# EAGLE design LARIX_V2 (EAGLE 6.5.0)
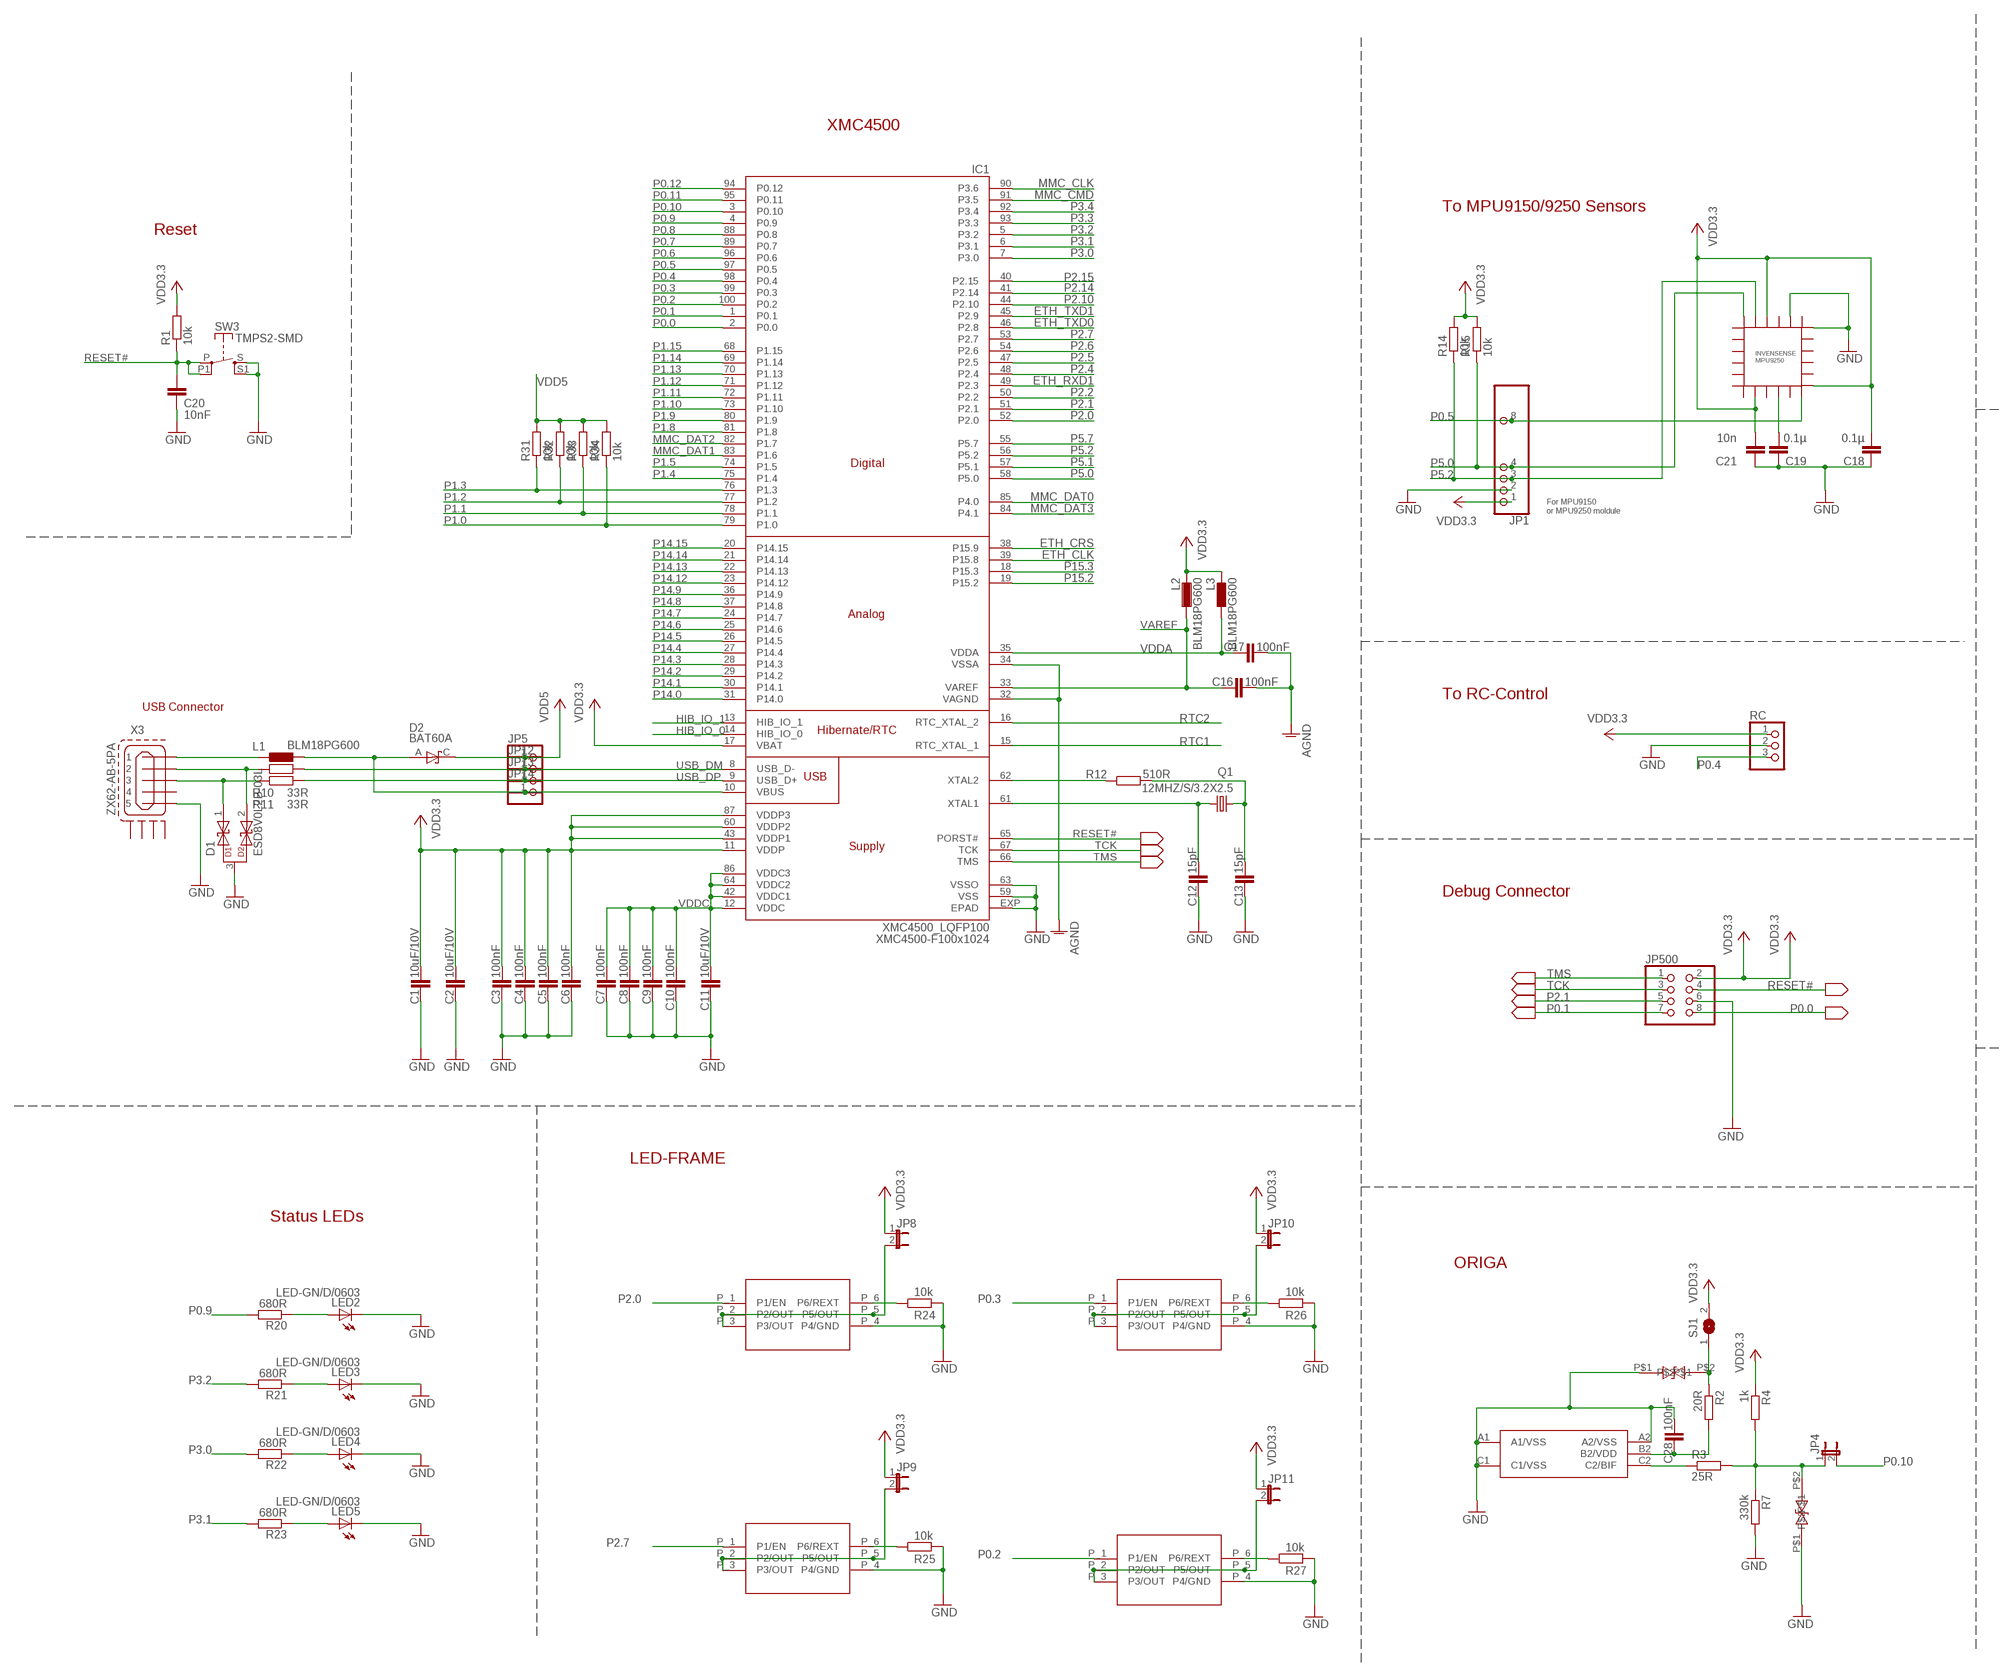
[diagram p0: schematic, sheet 1, part 1 of 2]
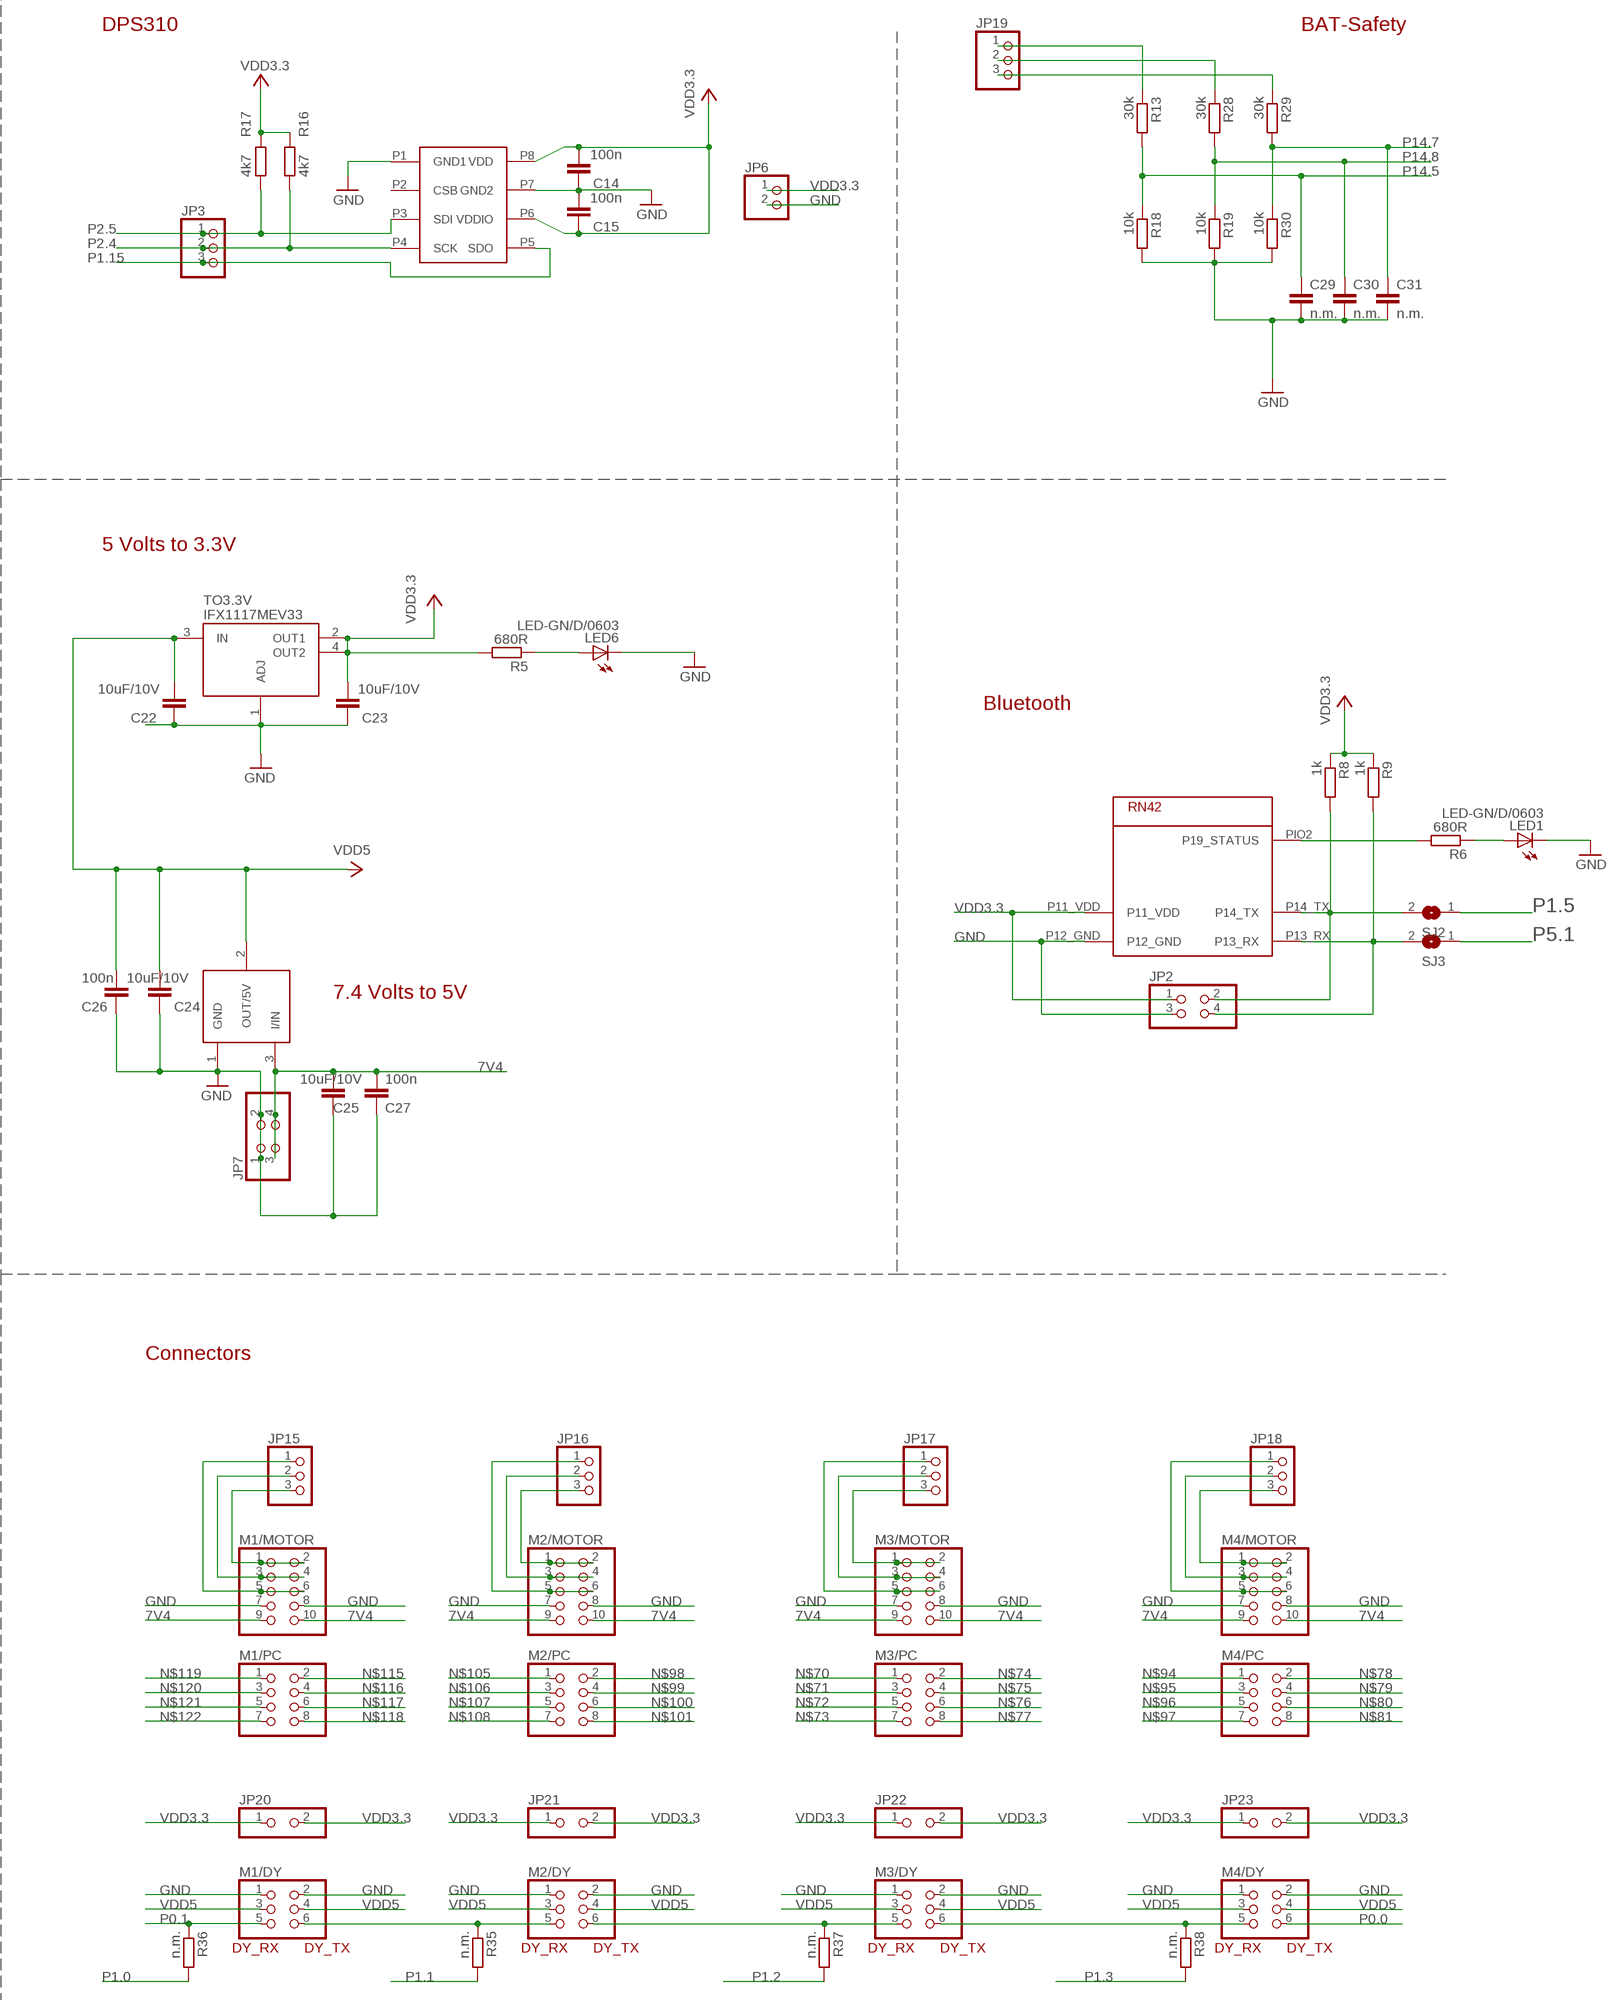
[diagram p1: schematic, sheet 1, part 2 of 2]

## Parts
C1  10uF/10V  C-EUC0805K  [C0805K]
C2  10uF/10V  C-EUC0805K  [C0805K]
C3  100nF  C-EUC0603  [C0603]
C4  100nF  C-EUC0603  [C0603]
C5  100nF  C-EUC0603  [C0603]
C6  100nF  C-EUC0603  [C0603]
C7  100nF  C-EUC0603  [C0603]
C8  100nF  C-EUC0603  [C0603]
C9  100nF  C-EUC0603  [C0603]
C10  100nF  C-EUC0603  [C0603]
C11  10uF/10V  C-EUC0805K  [C0805K]
C12  15pF  C-EUC0603  [C0603]
C13  15pF  C-EUC0603  [C0603]
C14  100n  C-EUC0603  [C0603]
C15  100n  C-EUC0603  [C0603]
C16  100nF  C-EUC0603  [C0603]
C17  100nF  C-EUC0603  [C0603]
C18  0.1µ  C-EUC0603  [C0603]
C19  0.1µ  C-EUC0603  [C0603]
C20  10nF  C-EUC0603  [C0603]
C21  10n  C-EUC0603  [C0603]
C22  10uF/10V  C-EUC0805K  [C0805K]
C23  10uF/10V  C-EUC0805K  [C0805K]
C24  10uF/10V  C-EUC0805K  [C0805K]
C25  10uF/10V  C-EUC0805K  [C0805K]
C26  100n  C-EUC0603  [C0603]
C27  100n  C-EUC0603  [C0603]
C28  100nF  C-EUC0603  [C0603]
C29  n.m.  C-EUC0603  [C0603]
C30  n.m.  C-EUC0603  [C0603]
C31  n.m.  C-EUC0603  [C0603]
D1  ESD8V0L2B-03L  [TSLP-3-1]
D2  BAT60A  BAT60  [SOD323-R]
IC1  XMC4500_LQFP100  XMC4400_LQFP100  [P/PG-LQFP-100-11]
IC2  INVENSENSE9250EHERBY  [QFN3X3-24+]
JP1  PINHD-1X10  [1X10]
JP2  PINHD-2X2  [2X02]
JP3  PINHD-1X3  [1X03]
JP4  JP1E  [JP1]
JP5  PINHD-1X1  [1X01]
JP6  PINHD-1X2  [1X02]
JP7  PINHD-2X2  [2X02]
JP8  JP1E  [JP1]
JP9  JP1E  [JP1]
JP10  JP1E  [JP1]
JP11  JP1E  [JP1]
JP12  PINHD-1X1  [1X01]
JP13  PINHD-1X1  [1X01]
JP14  PINHD-1X1  [1X01]
JP15  PINHD-1X3  [1X03]
JP16  PINHD-1X3  [1X03]
JP17  PINHD-1X3  [1X03]
JP18  PINHD-1X3  [1X03]
JP19  PINHD-1X3  [1X03]
JP20  PINHD-2X3  [2X03]
JP21  PINHD-2X3  [2X03]
JP22  PINHD-2X3  [2X03]
JP23  PINHD-2X3  [2X03]
JP500  PINHD-2X4  [2X04]
L1  BLM18PG600  L_EU_L0603  [L1608]
L2  BLM18PG600  L_EU_L0603  [L1608]
L3  BLM18PG600  L_EU_L0603  [L1608]
LED1  LED-GN/D/0603  LEDCHIPLED_0603  [CHIPLED_0603]
LED2  LED-GN/D/0603  LEDCHIPLED_0603  [CHIPLED_0603]
LED3  LED-GN/D/0603  LEDCHIPLED_0603  [CHIPLED_0603]
LED4  LED-GN/D/0603  LEDCHIPLED_0603  [CHIPLED_0603]
LED5  LED-GN/D/0603  LEDCHIPLED_0603  [CHIPLED_0603]
LED6  LED-GN/D/0603  LEDCHIPLED_0603  [CHIPLED_0603]
M1/DY  PINHD-2X3  [2X03]
M1/MOTOR  PINHD-2X5  [2X05]
M1/PC  PINHD-2X4  [2X04]
M2/DY  PINHD-2X3  [2X03]
M2/MOTOR  PINHD-2X5  [2X05]
M2/PC  PINHD-2X4  [2X04]
M3/DY  PINHD-2X3  [2X03]
M3/MOTOR  PINHD-2X5  [2X05]
M3/PC  PINHD-2X4  [2X04]
M4/DY  PINHD-2X3  [2X03]
M4/MOTOR  PINHD-2X5  [2X05]
M4/PC  PINHD-2X4  [2X04]
Q1  12MHZ/S/3.2X2.5  NX3225_2  [32X25_4PAD]
R1  10k  R-EU_R0603  [R0603]
R2  20R  R-EU_R0603  [R0603]
R3  25R  R-EU_R0603  [R0603]
R4  1k  R-EU_R0603  [R0603]
R5  680R  R-EU_R0603  [R0603]
R6  680R  R-EU_R0603  [R0603]
R7  330k  R-EU_R0603  [R0603]
R8  1k  R-EU_R0603  [R0603]
R9  1k  R-EU_R0603  [R0603]
R10  33R  R-EU_R0603  [R0603]
R11  33R  R-EU_R0603  [R0603]
R12  510R  R-EU_R0603  [R0603]
R13  30k  R-EU_R0603  [R0603]
R14  10k  R-EU_R0603  [R0603]
R15  10k  R-EU_R0603  [R0603]
R16  4k7  R-EU_R0603  [R0603]
R17  4k7  R-EU_R0603  [R0603]
R18  10k  R-EU_R0603  [R0603]
R19  10k  R-EU_R0603  [R0603]
R20  680R  R-EU_R0603  [R0603]
R21  680R  R-EU_R0603  [R0603]
R22  680R  R-EU_R0603  [R0603]
R23  680R  R-EU_R0603  [R0603]
R24  10k  R-EU_R0603  [R0603]
R25  10k  R-EU_R0603  [R0603]
R26  10k  R-EU_R0603  [R0603]
R27  10k  R-EU_R0603  [R0603]
R28  30k  R-EU_R0603  [R0603]
R29  30k  R-EU_R0603  [R0603]
R30  10k  R-EU_R0603  [R0603]
R31  10k  R-EU_R0603  [R0603]
R32  10k  R-EU_R0603  [R0603]
R33  10k  R-EU_R0603  [R0603]
R34  10k  R-EU_R0603  [R0603]
R35  n.m.  R-EU_R0603  [R0603]
R36  n.m.  R-EU_R0603  [R0603]
R37  n.m.  R-EU_R0603  [R0603]
R38  n.m.  R-EU_R0603  [R0603]
RC  PINHD-1X3  [1X03]
SJ1  SJ  [SJ]
SJ2  SJ  [SJ]
SJ3  SJ  [SJ]
SW3  TMPS2-SMD  FSM2JSMA  [FSM2JSMA]
TO3.3V  IFX1117MEV33  IFX1117  [SOT223]
U$7  TLE4284V50  [INF-PG-TO252-3-1_L_1PRIMARY]
U$8  DPS310DRUCKSENSOR  [LGA8R125P0X4_500X300X120]
U$9  ESD218-B1-02EL  [TSLP-2-20]
U$11  ORIGA2L  [WLB-5]
U$13  BCU320  [SC74]
U$15  BCU320  [SC74]
U$16  BLUETOOTHRN42  [ROVING-SHORT]
U$18  BCU320  [SC74]
U$20  BCU320  [SC74]
U$22  ESD218-B1-02EL  [TSLP-2-20]
X3  ZX62-AB-5PA  ZX62-AB-5PA_MICRO-USB  [ZX62-AB-5PA_MICRO-USB]

## Nets
7V4: C25.1 C27.1 JP7.3 JP7.4 M1/MOTOR.9 M1/MOTOR.10 M2/MOTOR.9 M2/MOTOR.10 M3/MOTOR.9 M3/MOTOR.10 M4/MOTOR.9 M4/MOTOR.10 U$7.3(I/IN)
AGND: C16.2 C17.2 IC1.32(VAGND) IC1.34(VSSA)
BLUETOOTHLED: R6.2 U$16.PIO2(P19_STATUS)
ETH_CLK: IC1.39(P15.8)
ETH_CRS: IC1.38(P15.9)
ETH_RXD1: IC1.49(P2.3)
ETH_TXD0: IC1.46(P2.8)
ETH_TXD1: IC1.45(P2.9)
GND: C1.2 C2.2 C3.2 C4.2 C5.2 C6.2 C7.2 C8.2 C9.2 C10.2 C11.2 C12.2 C13.2 C14.2 C15.1 C18.1 C19.1 C20.2 C21.1 C22.2 C23.2 C24.2 C25.2 C26.2 C27.2 C28.1 C29.2 C30.2 C31.2 D1.3 IC1.59(VSS) IC1.63(VSSO) IC1.EXP(EPAD) IC2.18 IC2.20 JP1.2 JP2.3 JP6.2 JP7.1 JP7.2 JP500.6 LED1.C LED2.C LED3.C LED4.C LED5.C LED6.C M1/DY.1 M1/DY.2 M1/MOTOR.7 M1/MOTOR.8 M2/DY.1 M2/DY.2 M2/MOTOR.7 M2/MOTOR.8 M3/DY.1 M3/DY.2 M3/MOTOR.7 M3/MOTOR.8 M4/DY.1 M4/DY.2 M4/MOTOR.7 M4/MOTOR.8 R7.2 R18.2 R19.2 R24.2 R25.2 R26.2 R27.2 R30.2 RC.2 SW3.S SW3.S1(S) TO3.3V.1(ADJ) U$7.1(GND) U$8.P1(GND1) U$8.P7(GND2) U$9.P$1 U$11.A1(A1/VSS) U$11.A2(A2/VSS) U$11.C1(C1/VSS) U$13.P_4(P4/GND) U$15.P_4(P4/GND) U$16.P12_GND U$18.P_4(P4/GND) U$20.P_4(P4/GND) U$22.P$1 X3.5
HIB_IO_0: IC1.14(HIB_IO_0)
HIB_IO_1: IC1.13(HIB_IO_1)
MMC_CLK: IC1.90(P3.6)
MMC_CMD: IC1.91(P3.5)
MMC_DAT0: IC1.85(P4.0)
MMC_DAT1: IC1.83(P1.6)
MMC_DAT2: IC1.82(P1.7)
MMC_DAT3: IC1.84(P4.1)
N$1: LED2.A R20.1
N$2: C28.2 R2.2 U$11.B2(B2/VDD)
N$3: LED3.A R21.1
N$6: IC1.62(XTAL2) R12.1
N$7: C13.1 Q1.3 R12.2
N$8: C12.1 IC1.61(XTAL1) Q1.1
N$9: JP4.1 R3.2 R4.2 R7.1 U$22.P$2
N$10: R2.1 SJ1.1 U$9.P$2
N$11: L1.2 X3.1
N$12: R3.1 U$11.C2(C2/BIF)
N$13: D1.2 R10.1 X3.2
N$14: JP15.1 M1/MOTOR.5 M1/MOTOR.6
N$15: LED6.A R5.1
N$16: M2/DY.6 M3/DY.5 R37.1
N$18: LED1.A R6.1
N$20: C19.2 IC2.10
N$21: JP15.2 M1/MOTOR.3 M1/MOTOR.4
N$22: LED4.A R22.1
N$23: D2.A IC1.10(VBUS) JP14.1 L1.1
N$24: LED5.A R23.1
N$25: JP15.3 M1/MOTOR.1 M1/MOTOR.2
N$26: R24.1 U$13.P_6(P6/REXT)
N$28: JP8.2 U$13.P_2(P2/OUT) U$13.P_3(P3/OUT) U$13.P_5(P5/OUT)
N$29: R25.1 U$15.P_6(P6/REXT)
N$30: JP9.2 U$15.P_2(P2/OUT) U$15.P_3(P3/OUT) U$15.P_5(P5/OUT)
N$31: R26.1 U$18.P_6(P6/REXT)
N$32: JP10.2 U$18.P_2(P2/OUT) U$18.P_3(P3/OUT) U$18.P_5(P5/OUT)
N$33: R27.1 U$20.P_6(P6/REXT)
N$34: JP11.2 U$20.P_2(P2/OUT) U$20.P_3(P3/OUT) U$20.P_5(P5/OUT)
N$35: JP16.1 M2/MOTOR.5 M2/MOTOR.6
N$36: D1.1 R11.1 X3.3
N$37: JP19.1 R13.1
N$38: JP16.3 M2/MOTOR.1 M2/MOTOR.2
N$40: JP16.2 M2/MOTOR.3 M2/MOTOR.4
N$41: JP19.2 R28.1
N$42: JP18.1 M4/MOTOR.5 M4/MOTOR.6
N$43: JP19.3 R29.1
N$45: JP18.3 M4/MOTOR.1 M4/MOTOR.2
N$46: JP18.2 M4/MOTOR.3 M4/MOTOR.4
N$49: JP17.1 M3/MOTOR.5 M3/MOTOR.6
N$50: JP17.2 M3/MOTOR.3 M3/MOTOR.4
N$53: JP17.3 M3/MOTOR.1 M3/MOTOR.2
N$54: M3/DY.6 M4/DY.5 R38.1
N$55: M1/DY.6 M2/DY.5 R35.1
N$70: M3/PC.1
N$71: M3/PC.3
N$72: M3/PC.5
N$73: M3/PC.7
N$74: M3/PC.2
N$75: M3/PC.4
N$76: M3/PC.6
N$77: M3/PC.8
N$78: M4/PC.2
N$79: M4/PC.4
N$80: M4/PC.6
N$81: M4/PC.8
N$94: M4/PC.1
N$95: M4/PC.3
N$96: M4/PC.5
N$97: M4/PC.7
N$98: M2/PC.2
N$99: M2/PC.4
N$100: M2/PC.6
N$101: M2/PC.8
N$105: M2/PC.1
N$106: M2/PC.3
N$107: M2/PC.5
N$108: M2/PC.7
N$115: M1/PC.2
N$116: M1/PC.4
N$117: M1/PC.6
N$118: M1/PC.8
N$119: M1/PC.1
N$120: M1/PC.3
N$121: M1/PC.5
N$122: M1/PC.7
P0.0: IC1.2(P0.0) JP500.8 M4/DY.6
P0.1: IC1.1(P0.1) JP500.7 M1/DY.5 R36.1
P0.2: IC1.100(P0.2) U$20.P_1(P1/EN)
P0.3: IC1.99(P0.3) U$18.P_1(P1/EN)
P0.4: IC1.98(P0.4) RC.3
P0.5: IC1.97(P0.5) IC2.12 JP1.8
P0.6: IC1.96(P0.6)
P0.7: IC1.89(P0.7)
P0.8: IC1.88(P0.8)
P0.9: IC1.4(P0.9) R20.2
P0.10: IC1.3(P0.10) JP4.2
P0.11: IC1.95(P0.11)
P0.12: IC1.94(P0.12)
P1.0: IC1.79(P1.0) R34.1 R36.2
P1.1: IC1.78(P1.1) R33.1 R35.2
P1.2: IC1.77(P1.2) R32.1 R37.2
P1.3: IC1.76(P1.3) R31.1 R38.2
P1.4: IC1.75(P1.4)
P1.5: IC1.74(P1.5) SJ2.1
P1.5B: JP2.4 R9.2 SJ3.2 U$16.P13_RX
P1.8: IC1.81(P1.8)
P1.9: IC1.80(P1.9)
P1.10: IC1.73(P1.10)
P1.11: IC1.72(P1.11)
P1.12: IC1.71(P1.12)
P1.13: IC1.70(P1.13)
P1.14: IC1.69(P1.14)
P1.15: IC1.68(P1.15) JP3.3 U$8.P5(SDO)
P2.0: IC1.52(P2.0) U$13.P_1(P1/EN)
P2.1: IC1.51(P2.1) JP500.5
P2.2: IC1.50(P2.2)
P2.4: IC1.48(P2.4) JP3.2 R16.2 U$8.P4(SCK)
P2.5: IC1.47(P2.5) JP3.1 R17.2 U$8.P3(SDI)
P2.6: IC1.54(P2.6)
P2.7: IC1.53(P2.7) U$15.P_1(P1/EN)
P2.10: IC1.44(P2.10)
P2.14: IC1.41(P2.14)
P2.15: IC1.40(P2.15)
P3.0: IC1.7(P3.0) R22.2
P3.1: IC1.6(P3.1) R23.2
P3.2: IC1.5(P3.2) R21.2
P3.3: IC1.93(P3.3)
P3.4: IC1.92(P3.4)
P5.0: IC1.58(P5.0) IC2.24 JP1.4 R15.1
P5.1: IC1.57(P5.1) SJ3.1
P5.1B: JP2.2 R8.2 SJ2.2 U$16.P14_TX
P5.2: IC1.56(P5.2) IC2.23 JP1.3 R14.1
P5.7: IC1.55(P5.7)
P14.0: IC1.31(P14.0)
P14.1: IC1.30(P14.1)
P14.2: IC1.29(P14.2)
P14.3: IC1.28(P14.3)
P14.4: IC1.27(P14.4)
P14.5: C29.1 IC1.26(P14.5) R13.2 R18.1
P14.6: IC1.25(P14.6)
P14.7: C31.1 IC1.24(P14.7) R29.2 R30.1
P14.8: C30.1 IC1.37(P14.8) R19.1 R28.2
P14.9: IC1.36(P14.9)
P14.12: IC1.23(P14.12)
P14.13: IC1.22(P14.13)
P14.14: IC1.21(P14.14)
P14.15: IC1.20(P14.15)
P15.2: IC1.19(P15.2)
P15.3: IC1.18(P15.3)
RESET#: C20.1 IC1.65(PORST#) JP500.4 R1.1 SW3.P SW3.P1(P)
RTC1: IC1.15(RTC_XTAL_1)
RTC2: IC1.16(RTC_XTAL_2)
TCK: IC1.67(TCK) JP500.3
TMS: IC1.66(TMS) JP500.1
USB_DM: IC1.8(USB_D-) JP12.1 R10.2
USB_DP: IC1.9(USB_D+) JP13.1 R11.2
VAREF: C16.1 IC1.33(VAREF) L2.1
VDD3.3: C1.1 C2.1 C3.1 C4.1 C5.1 C6.1 C14.1 C15.2 C18.2 C21.2 C23.1 IC1.11(VDDP) IC1.17(VBAT) IC1.43(VDDP1) IC1.60(VDDP2) IC1.87(VDDP3) IC2.8 IC2.13 IC2.22 JP1.1 JP2.1 JP6.1 JP8.1 JP9.1 JP10.1 JP11.1 JP20.1 JP20.2 JP21.1 JP21.2 JP22.1 JP22.2 JP23.1 JP23.2 JP500.2 L2.2 L3.2 R1.2 R4.1 R5.2 R8.1 R9.1 R14.2 R15.2 R16.1 R17.1 RC.1 SJ1.2 TO3.3V.2(OUT1) TO3.3V.4(OUT2) U$8.P6(VDDIO) U$8.P8(VDD) U$16.P11_VDD
VDD5: C22.1 C24.1 C26.1 D2.C JP5.1 M1/DY.3 M1/DY.4 M2/DY.3 M2/DY.4 M3/DY.3 M3/DY.4 M4/DY.3 M4/DY.4 R31.2 R32.2 R33.2 R34.2 TO3.3V.3(IN) U$7.2(OUT/5V)
VDDA: C17.1 IC1.35(VDDA) L3.1
VDDC: C7.1 C8.1 C9.1 C10.1 C11.1 IC1.12(VDDC) IC1.42(VDDC1) IC1.64(VDDC2) IC1.86(VDDC3)
Unconnected: IC2.1 IC2.2 IC2.3 IC2.4 IC2.5 IC2.6 IC2.7 IC2.9 IC2.11 IC2.14 IC2.15 IC2.16 IC2.17 IC2.19 IC2.21 U$8.P2(CSB) X3.4 X3.S1(S:S1) X3.S2(S:S2) X3.S3(S:S3) X3.S4(S:S4)

## Notes on the sheet
- LARIX Quadrocopter Control with XMC4500 V2 (05.10.2015)
- DPS310 | BAT-Safety
- XMC4500
- To MPU9150/9250 Sensors
- Reset
- 5 Volts to 3.3V
- For MPU9150
  or MPU9250 moldule
- Bluetooth
- To RC-Control
- USB Connector
- X3
- 7.4 Volts to 5V
- Debug Connector
- XMC4500-F100x1024
- Connectors
- LED-FRAME
- Status LEDs
- ORIGA
- DY_RX | DY_TX | DY_RX | DY_TX | DY_RX | DY_TX | DY_RX | DY_TX

## Library data of the parts
C1 C2 C11 C22-C25 = HMI_OLED-V1:C-EU: CAPACITOR, European symbol
C3-C10 C12-C21 C26-C31 = resistor:C-EU: CAPACITOR, European symbol
D1 = DsDiod:ESD8V0L2B-03L
D2 = BAT60:BAT60; A: A; B: B
IC1 = XMC4000_v4.16:XMC4400_LQFP100
IC2 = invensense9250:INVENSENSE9250: Herbys Model of a invensense 9250
JP1 = pinhead:PINHD-1X10: PIN HEADER
JP2 JP7 = pinhead:PINHD-2X2: PIN HEADER
JP3 JP15-JP19 RC = pinhead:PINHD-1X3: PIN HEADER
JP4 JP8-JP11 = jumper:JP1E: JUMPER
JP5 JP12-JP14 = pinhead:PINHD-1X1: PIN HEADER
JP6 = pinhead:PINHD-1X2: PIN HEADER
JP20-JP23 = pinhead_2we:PINHD-2X3: PIN HEADER
JP500 M1/PC M2/PC M3/PC M4/PC = pinhead:PINHD-2X4: PIN HEADER
L1-L3 = PDFerr:L_EU_
LED1-LED6 = led:LED: LED OSRAM: - CHIPLED LG R971, LG N971, LY N971, LG Q971, LY Q971, LO R971, LY R971 LH N974, LH R974 LS Q976, LO Q976, LY Q976 LO Q996 - Hyper CHIPLED LW Q18S LB Q993, LB Q99A, LB R99A - SideLED LS A670, LO A670, LY A670, LG A670, LP A670 LB A673, LV A673, LT A673, LW A673 LH A674 LY A675 LS A676, LA A676, LO A676, LY A676, LW A676 LS A679, LY A679, LG A679 - Hyper Micro SIDELED® LS Y876, LA Y876, LO Y876, LY Y876 LT Y87S - SmartLED LW L88C, LW L88S LB L89C, LB L89S, LG L890 LS L89K, LO L89K, LY L89K LS L896, LA L896, LO L896, LY L896 - TOPLED LS T670, LO T670, LY T670, LG T670, LP T670 LSG T670, LSP T670, LSY T670, LOP T670, LYG T670 LG T671, LOG T671, LSG T671 LB T673, LV T673, LT T673, LW T673 LH T674 LS T676, LA T676, LO T676, LY T676, LB T676, LH T676, LSB T676, LW T676 LB T67C, LV T67C, LT T67C, LS T67K, LO T67K, LY T67K, LW E67C LS E67B, LA E67B, LO E67B, LY E67B, LB E67C, LV E67C, LT E67C LW T67C LS T679, LY T679, LG T679 LS T770, LO T770, LY T770, LG T770, LP T770 LB T773, LV T773, LT T773, LW T773 LH T774 LS E675, LA E675, LY E675, LS T675 LS T776, LA T776, LO T776, LY T776, LB T776 LHGB T686 LT T68C, LB T68C - Hyper Mini TOPLED® LB M676 - Mini TOPLED Santana® LG M470 LS M47K, LO M47K, LY M47K Source: http://www.osram.convergy.de - LUMILED® LXK2-PW12-R00, LXK2-PW12-S00, LXK2-PW14-U00, LXK2-PW14-V00 LXK2-PM12-R00, LXK2-PM12-S00, LXK2-PM14-U00 LXK2-PE12-Q00, LXK2-PE12-R00, LXK2-PE12-S00, LXK2-PE14-T00, LXK2-PE14-U00 LXK2-PB12-K00, LXK2-PB12-L00, LXK2-PB12-M00, LXK2-PB14-N00, LXK2-PB14-P00, LXK2-PB14-Q00 LXK2-PR12-L00, LXK2-PR12-M00, LXK2-PR14-Q00, LXK2-PR14-R00 LXK2-PD12-Q00, LXK2-PD12-R00, LXK2-PD12-S00 LXK2-PH12-R00, LXK2-PH12-S00 LXK2-PL12-P00, LXK2-PL12-Q00, LXK2-PL12-R00 Source: www.luxeon.com
M1/DY M2/DY M3/DY M4/DY = pinhead:PINHD-2X3: PIN HEADER
M1/MOTOR M2/MOTOR M3/MOTOR M4/MOTOR = pinhead:PINHD-2X5: PIN HEADER
Q1 = Quarz:NX3225_2
R1 R10 R11 R14-R17 R24-R27 R31-R34 = resistor:R-EU_: RESISTOR, European symbol
R2-R9 R12 R13 R18-R23 R28-R30 R35-R38 = DsR:R-EU_R0603
SJ1-SJ3 = jumper:SJ: SMD solder JUMPER
SW3 = MSwitch:FSM2JSMA
TO3.3V = IvregL:IFX1117
U$7 = voltagereg_lin_TO252-3-1L:TLE4284V50
U$8 = drucksensorDPS310:DPS310DRUCKSENSOR
U$9 U$22 = ESD218-B1:ESD218-B1-02EL
U$11 = ORIGA:ORIGA2L
U$13 U$15 U$18 U$20 = LEDtreiber BCR320U:BCU320
U$16 = bluetoothRN42:BLUETOOTHRN42
X3 = XSRRND:ZX62-AB-5PA_MICRO-USB

## Board
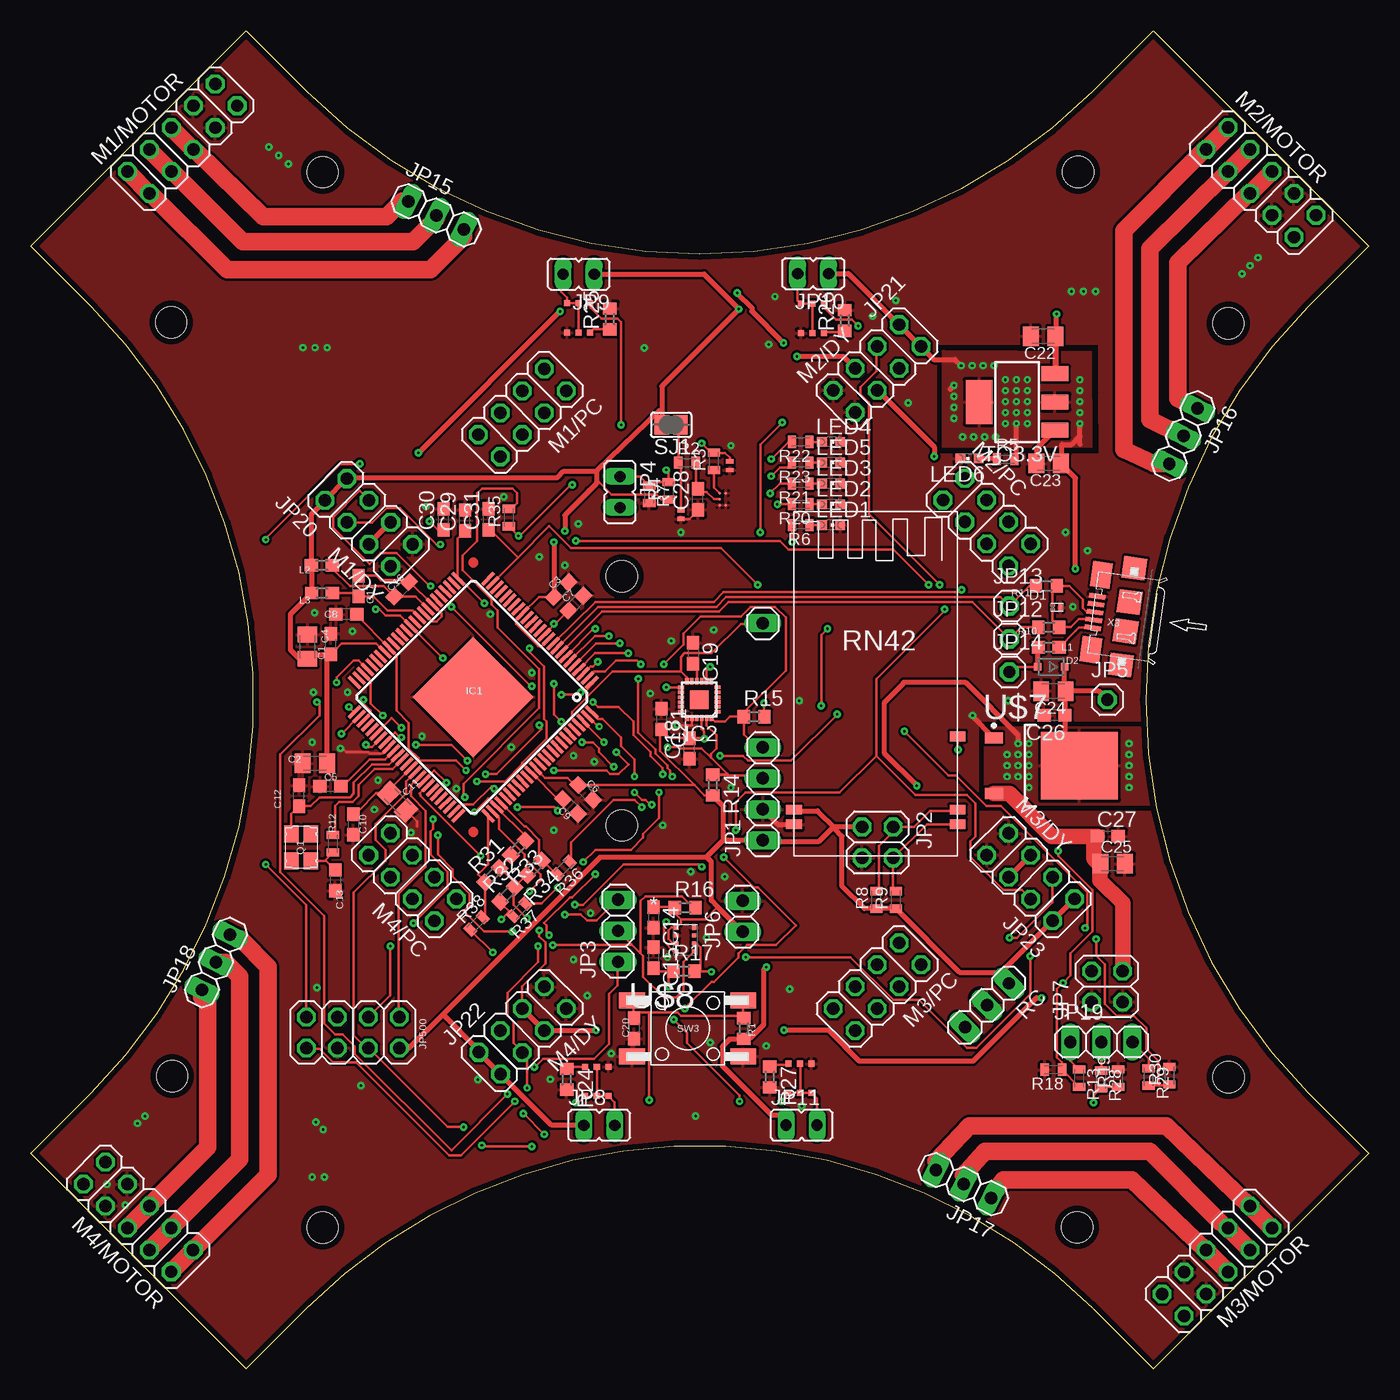
[diagram p2: board, top side]
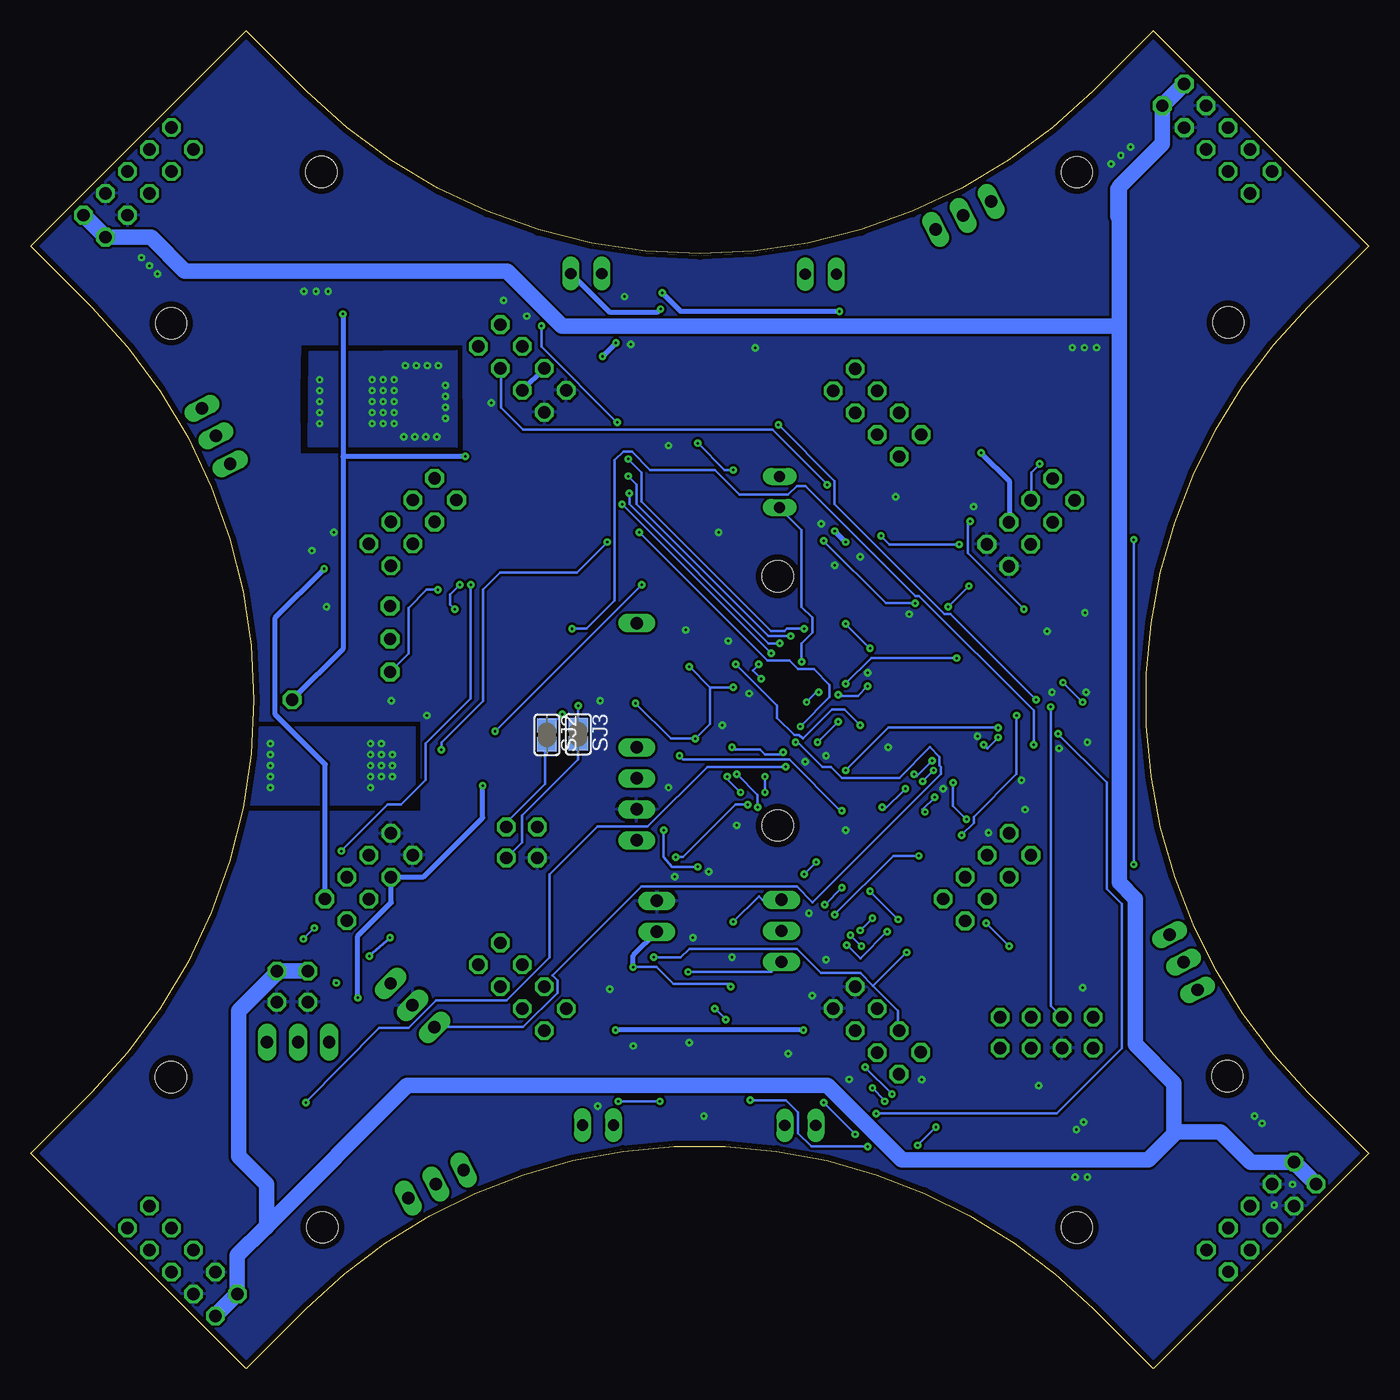
[diagram p3: board, bottom side, seen from below]

Size 109.6 x 109.6 mm. Coordinates in mm from the lower left corner, seen from the top.
Outline: 22.63,4.95 17.68,0 0,17.68 4.95,22.63 arc90 4.95,86.97 0,91.92 17.68,109.6 22.63,104.65 arc90 86.97,104.65 91.92,109.6 109.6,91.92 104.65,86.97 arc90 104.65,22.63 109.6,17.68 91.92,0 86.97,4.95 arc90 22.63,4.95
Outline: 22.63,4.95 22.63,4.95
Copper layers (1*16): Top 0.035mm / dielectric 1.5mm / Bottom 0.035mm
Design rules "Hitzex_CPU_45A *": minimum track width 0.2mm, minimum drill 0.2mm, track to track 0.2mm, track to pad 0.2mm, pad to pad 0.2mm, via to via 0.2mm, smd to smd 0.2mm, copper to edge 0.5mm, drill to drill 0.5mm, minimum pad ring 7mil, minimum via ring 0.2mm, stop-mask expansion 4mil, vias tented up to drill 0.2mm, thermal gap 10mil
Holes 2.54 mm at 48.42,44.5 48.42,64.9 23.92,98 11.52,85.7 11.61,23.98 23.91,11.58 98.08,85.61 85.78,98.01 85.71,11.59 98.11,23.89

### Footprints (pad centres in the part's own frame; a part is rotated, then mirrored left to right if it is on the bottom)
C0805K = smd 1.3 x 1.6: 1 -1,0; 2 1,0
C0603 = smd 1.1 x 1: 1 -0.85,0; 2 0.85,0
TSLP-3-1 = smd 0.225 x 0.35: 1 0.113,-0.475; 2 0.487,-0.475 | smd 0.6 x 0.35: 3 0.3,0.175
SOD323-R = smd 0.6 x 0.6: A 1.1,0; C -1.1,0
P/PG-LQFP-100-11 = smd 1.35 x 0.29: 1 -7.725,6; 2 -7.725,5.5; 3 -7.725,5; 4 -7.725,4.5; 5 -7.725,4; 6 -7.725,3.5; 7 -7.725,3; 8 -7.725,2.5; 9 -7.725,2; 10 -7.725,1.5; 11 -7.725,1; 12 -7.725,0.5; 13 -7.725,0; 14 -7.725,-0.5; 15 -7.725,-1; 16 -7.725,-1.5; 17 -7.725,-2; 18 -7.725,-2.5; 19 -7.725,-3; 20 -7.725,-3.5; 21 -7.725,-4; 22 -7.725,-4.5; 23 -7.725,-5; 24 -7.725,-5.5; 25 -7.725,-6; 51 7.725,-6; 52 7.725,-5.5; 53 7.725,-5; 54 7.725,-4.5; 55 7.725,-4; 56 7.725,-3.5; 57 7.725,-3; 58 7.725,-2.5; 59 7.725,-2; 60 7.725,-1.5; 61 7.725,-1; 62 7.725,-0.5; 63 7.725,0; 64 7.725,0.5; 65 7.725,1; 66 7.725,1.5; 67 7.725,2; 68 7.725,2.5; 69 7.725,3; 70 7.725,3.5; 71 7.725,4; 72 7.725,4.5; 73 7.725,5; 74 7.725,5.5; 75 7.725,6 | smd 0.29 x 1.35: 26 -6,-7.725; 27 -5.5,-7.725; 28 -5,-7.725; 29 -4.5,-7.725; 30 -4,-7.725; 31 -3.5,-7.725; 32 -3,-7.725; 33 -2.5,-7.725; 34 -2,-7.725; 35 -1.5,-7.725; 36 -1,-7.725; 37 -0.5,-7.725; 38 0,-7.725; 39 0.5,-7.725; 40 1,-7.725; 41 1.5,-7.725; 42 2,-7.725; 43 2.5,-7.725; 44 3,-7.725; 45 3.5,-7.725; 46 4,-7.725; 47 4.5,-7.725; 48 5,-7.725; 49 5.5,-7.725; 50 6,-7.725; 76 6,7.725; 77 5.5,7.725; 78 5,7.725; 79 4.5,7.725; 80 4,7.725; 81 3.5,7.725; 82 3,7.725; 83 2.5,7.725; 84 2,7.725; 85 1.5,7.725; 86 1,7.725; 87 0.5,7.725; 88 0,7.725; 89 -0.5,7.725; 90 -1,7.725; 91 -1.5,7.725; 92 -2,7.725; 93 -2.5,7.725; 94 -3,7.725; 95 -3.5,7.725; 96 -4,7.725; 97 -4.5,7.725; 98 -5,7.725; 99 -5.5,7.725; 100 -6,7.725 | smd 7 x 7: EXP 0,0
QFN3X3-24+ = smd 0.5 x 0.3: 1 -1.5,0.996; 2 -1.5,0.596; 3 -1.5,0.196; 4 -1.5,-0.204; 5 -1.5,-0.604; 6 -1.5,-1.004; 13 1.5,-0.996; 14 1.5,-0.596; 15 1.5,-0.196; 16 1.5,0.204; 17 1.5,0.596; 18 1.5,1.004 | smd 0.3 x 0.5: 7 -0.996,-1.5; 8 -0.596,-1.5; 9 -0.196,-1.5; 10 0.204,-1.5; 11 0.604,-1.5; 12 1.004,-1.5; 19 0.996,1.5; 20 0.596,1.5; 21 0.196,1.5; 22 -0.204,1.5; 23 -0.604,1.5; 24 -1.004,1.5 | smd 1.5 x 1.5: EXP 0,0
1X10 = drill 1.016 long: 1 -11.43,0; 2 -8.89,0; 3 -6.35,0; 4 -3.81,0; 8 6.35,0
2X02 = drill 1.016 octagon: 1 -1.27,-1.27; 2 -1.27,1.27; 3 1.27,-1.27; 4 1.27,1.27
1X03 = drill 1.016 long: 1 -2.54,0; 2 0,0; 3 2.54,0
JP1 = drill 0.914 long: 1 0,-1.27; 2 0,1.27
1X01 = drill 1.016 octagon: 1 0,0
1X02 = drill 1.016 long: 1 -1.27,0; 2 1.27,0
2X03 = drill 1.016 octagon: 1 -2.54,-1.27; 2 -2.54,1.27
2X04 = drill 1.016 octagon: 1 -3.81,-1.27; 2 -3.81,1.27; 3 -1.27,-1.27; 4 -1.27,1.27; 5 1.27,-1.27; 6 1.27,1.27; 7 3.81,-1.27; 8 3.81,1.27
L1608 = smd 1.1 x 1: 1 -0.85,0; 2 0.85,0
CHIPLED_0603 = smd 0.8 x 0.8: A 0,-0.75; C 0,0.75
2X03' = drill 1.016 octagon: 1 -2.54,-1.27; 2 -2.54,1.27; 3 0,-1.27; 4 0,1.27; 5 2.54,-1.27; 6 2.54,1.27
2X05 = drill 1.016 octagon: 1 -5.08,-1.27; 2 -5.08,1.27; 3 -2.54,-1.27; 4 -2.54,1.27; 5 0,-1.27; 6 0,1.27; 7 2.54,-1.27; 8 2.54,1.27; 9 5.08,-1.27; 10 5.08,1.27
32X25_4PAD = smd 1.4 x 1.2: 1 -1.1,-0.8; 2 1.1,-0.8; 3 1.1,0.8; 4 -1.1,0.8
R0603 = smd 1 x 1.1: 1 -0.85,0; 2 0.85,0
R0603' = smd 0.67 x 1: 1 -0.715,0; 2 0.715,0
SJ = smd 1.168 x 1.6: 1 -0.762,0; 2 0.762,0
FSM2JSMA = smd 2.1 x 1.3: P -4.55,-2.3; P1 4.55,-2.3; S -4.55,2.3; S1 4.55,2.3
SOT223 = smd 1.219 x 2.235: 1 -2.311,-3.099; 2 0,-3.099; 3 2.311,-3.099 | smd 3.6 x 2.2: 4 0,3.099
INF-PG-TO252-3-1_L_1PRIMARY = smd 1.45 x 0.9: 1 -4.7,2.28; 3 -4.7,-2.28 | smd 6.3 x 5.55: 2 2.3,0
LGA8R125P0X4_500X300X120 = smd 0.35 x 0.35: P1 0.725,0.975; P2 0.725,0.325; P3 0.725,-0.325; P4 0.725,-0.975; P5 -0.725,-0.975; P6 -0.725,-0.325; P7 -0.725,0.325; P8 -0.725,0.975
TSLP-2-20 = smd 0.6 x 0.35: P$1 0.1,0.4; P$2 0.1,-0.3
WLB-5 = smd 0.25 x 0.25: A1 -0.19,-0.27; A2 -0.19,0.23; B2 0.31,0.23; C1 0.81,-0.27; C2 0.81,0.23
SC74 = smd 0.5 x 0.5: P_1 -0.05,-2.2; P_2 0.9,-2.2; P_3 1.85,-2.2; P_4 1.85,0.2; P_5 0.9,0.2; P_6 -0.05,0.2
ROVING-SHORT = smd 1.3 x 0.8: P11_VDD 0.1,0.9; P12_GND 0.1,-0.3; P13_RX 13.5,-0.3; P14_TX 13.5,0.9; PIO2 13.5,6.9
ZX62-AB-5PA_MICRO-USB = smd 0.4 x 1.35: 1 -1.3,1.45; 2 -0.65,1.45; 3 0,1.45; 4 0.65,1.45; 5 1.3,1.45 | smd 2.1 x 1.6: S1 -3.1,1.35; S2 3.1,1.35 | smd 1.8 x 1.9: S3 -4,-1.25; S4 4,-1.25 | smd 1.9 x 1.9: S5 -1.2,-1.25; S6 1.2,-1.25

### Placement (x,y rotation side)
C1  22.68,59.15 90 top
C2  23.28,49.6 180 top
C3  43.46,63.81 45 top
C4  24.59,59.37 90 top
C5  24.56,47.71 180 top
C6  45.46,47.21 315 top
C7  44.66,62.71 45 top
C8  25.86,61.8 180 top
C9  44.22,46.07 315 top
C10  26.43,44.58 270 top
C11  30.05,46.44 315 top
C12  21.99,46.94 90 top
C13  24.96,40.01 270 top
C14  51.01,36.97 270 top
C15  51.01,33.67 270 top
C16  30.39,63.84 45 top
C17  26.86,64.11 90 top
C18  53.96,50.81 90 top
C19  54.26,58.61 270 top
C20  49.41,27.88 270 top
C21  51.66,53.21 270 top
C22  82.92,84.57 180 top
C23  83.38,74.15 180 top
C24  83.76,55.51 180 top
C25  88.62,41.36 0 top
C26  83.85,53.52 180 top
C27  88.22,43.62 0 top
C28  54.66,71.21 90 top
C29  35.58,69.48 90 top
C30  33.83,69.57 90 top
C31  37.52,69.58 90 top
D1  84.17,62.66 270 top
D2  83.57,57.49 180 top
IC1  36.25,55.01 225 top
IC2  54.76,54.81 180 top
JP1  59.96,54.71 90 top
JP2  69.36,43.11 270 top
JP3  48.11,35.87 90 top
JP4  48.26,71.81 180 top
JP5  88.18,54.8 0 top
JP6  58.31,37.07 90 top
JP7  88.16,31.31 90 top
JP8  46.57,19.95 270 top
JP9  44.89,89.65 90 top
JP10  64.09,89.7 90 top
JP11  63.14,19.96 270 top
JP12  80.16,59.77 0 top
JP13  80.16,62.47 0 top
JP14  80.16,57.07 0 top
JP15  33.22,94.47 333 top
JP16  94.4,76.4 243 top
JP17  76.4,15.14 153 top
JP18  15.18,33.3 63 top
JP19  87.69,26.77 0 top
JP20  23.21,73.81 135 top
JP21  73.82,86.42 45 top
JP22  39.39,26.83 45 top
JP23  82.79,39.39 135 top
JP500  26.4,27.54 180 top
L1  83.38,59.09 0 top
L2  23.86,65.81 180 top
L3  23.87,63.54 180 top
LED1  65.56,69.11 270 top
LED2  65.56,70.81 270 top
LED3  65.56,72.51 270 top
LED4  65.56,75.91 270 top
LED5  65.56,74.21 270 top
LED6  76.89,74.56 90 top
M1/DY  [2X03']  28.59,68.43 135 top
M1/MOTOR  12.43,100.75 45 top
M1/PC  40.27,78.31 225 top
M2/DY  [2X03']  68.42,81.04 45 top
M2/MOTOR  100.77,97.17 315 top
M2/PC  78.31,69.36 315 top
M3/DY  [2X03']  81,41.18 315 top
M3/MOTOR  97.17,8.83 225 top
M3/PC  69.33,31.3 225 top
M4/DY  [2X03']  41.17,28.61 225 top
M4/MOTOR  8.82,12.45 135 top
M4/PC  31.28,40.28 135 top
Q1  22.16,42.71 270 top
R1  58.41,27.88 270 top
R2  20R  [R0603']  53.76,74.21 0 top
R3  25R  [R0603']  55.96,74.31 90 top
R4  1k  [R0603']  52.26,71.91 90 top
R5  680R  [R0603']  79.86,74.5 0 top
R6  680R  [R0603']  63.06,69.11 180 top
R7  330k  [R0603']  50.66,71.61 270 top
R8  1k  [R0603']  69.26,38.41 90 top
R9  1k  [R0603']  70.86,38.41 90 top
R10  83.37,60.74 180 top
R11  83.19,64.12 180 top
R12  510R  [R0603']  24.76,43.01 270 top
R13  30k  [R0603']  85.86,23.81 270 top
R14  55.86,47.81 270 top
R15  59.26,53.41 0 top
R16  53.61,37.77 0 top
R17  53.51,32.57 0 top
R18  10k  [R0603']  83.76,24.51 180 top
R19  10k  [R0603']  89.06,23.81 90 top
R20  680R  [R0603']  63.06,70.81 180 top
R21  680R  [R0603']  63.06,72.51 180 top
R22  680R  [R0603']  63.06,75.91 180 top
R23  680R  [R0603']  63.06,74.21 180 top
R24  43.91,23.72 270 top
R25  47.44,85.98 90 top
R26  66.68,85.86 90 top
R27  60.54,23.91 270 top
R28  30k  [R0603']  87.66,23.71 270 top
R29  30k  [R0603']  91.56,23.91 270 top
R30  10k  [R0603']  93.26,24.01 90 top
R31  37.82,40.44 45 top
R32  39.05,38.87 45 top
R33  39.93,42.68 225 top
R34  41.27,41.06 225 top
R35  n.m.  [R0603']  39.16,69.71 90 top
R36  n.m.  [R0603']  43.65,41.04 225 top
R37  n.m.  [R0603']  40.02,37.58 225 top
R38  n.m.  [R0603']  36.52,36.48 45 top
RC  78.32,29.78 225 top
SJ1  52.46,77.31 180 top
SJ2  67.32,51.92 270 bottom
SJ3  64.75,51.97 270 bottom
SW3  53.81,27.88 180 top
TO3.3V  80.78,79.18 90 top
U$7  83.59,49.4 0 top
U$8  53.61,35.17 0 top
U$9  53.36,70.01 180 top
U$11  56.66,70.91 90 top
U$12  [INFINEON_ICON_3-SILK]  31.28,21.34 0 top
U$13  45.47,24.55 0 top
U$15  45.78,85.06 180 top
U$16  62.42,44.9 0 top
U$18  64.93,85.03 180 top
U$20  62.11,24.8 0 top
U$22  57.36,74.01 180 top
X3  88.6,61.78 82 top

### Tracks (layer width: path | path; a pad name or v marks a point on that pad's centre or on a via)
7V4
  Top 1.27: U$7.3 80.15,47.12 83.65,43.62 C27.1 87.06,43.31 87.06,41.81 87.51,41.36 C25.1 87.56,41.3 87.56,40.01 89.43,38.14 JP7.3
  Bottom 1.27: M3/MOTOR.10 M3/MOTOR.9 92.68,9.3 90.36,11.61 | M4/MOTOR.10 M4/MOTOR.9 9.68,16.94 12.16,19.41 15.76,19.41 15.96,19.21 | 90.36,11.61 78.76,23.21 44.36,23.21 38.26,17.11 18.06,17.11 15.96,19.21 | M1/MOTOR.10 M1/MOTOR.9 16.92,100.35 20.46,96.81 20.46,96.71 20.56,96.61 20.56,96.51 | M2/MOTOR.10 M2/MOTOR.9 99.73,92.68 96.96,89.91 70.56,89.91 66.06,85.41 20.56,85.41 20.46,85.51 | JP7.4 JP7.3 89.43,32.44 92.56,29.31 92.56,17.41 90.26,15.11 90.26,11.61 90.36,11.61 | 20.56,96.51 20.56,94.41 | 20.46,85.51 20.46,96.41 20.56,96.51 | 20.46,85.51 20.46,39.82 19.13,38.49 19.13,26.57 15.96,23.4 15.96,19.21
AGND
  Top 0.2: IC1.34 32.87,61.21 33.26,61.21 33.66,61.61 33.66,61.84 IC1.32 31.06,64.44 C16.2 30.82,64.61 28.66,64.61 28.31,64.96 C17.2
BLUETOOTHLED  (via drill 0.2)
  Top 0.2: v62.36,67.71 62.36,69.1 R6.2 | U$16.PIO2 75.92,50.75 v75.96,50.71
  Bottom 0.2: v75.96,50.71 75.96,51.31 72.56,54.71 72.56,63.81 71.16,65.21 64.86,65.21 v62.36,67.71
GND  (via drill 0.2)
  Top 0.2: 36.26,57.91 36.25,57.71 IC1.EXP | C11.2 31.66,44.84 31.66,44.41 | IC1.59 28.83,50.41 27.76,50.41 27.66,50.51 25.86,50.51 25.56,50.81 v25.36,50.81 | U$9.P$1 53.96,69.61 54.66,70.31 C28.1 | IC2.20 54.16,52.72 54.16,52.71 v52.96,52.71
  Top 0.406: TO3.3V.1 82.38,75.37 C23.2 | U$7.1 77.08,53.49 76.98,53.49 | JP1.2 61.18,44.6 U$16.P12_GND
  Bottom 0.2: M4/DY.1 42.06,31.21 42.04,31.19
  other vias: 45.86,37.31 23.26,61.91 37.66,61.81 85.36,62.41 55.36,35.31 52.46,59.61 32.06,51.81 26.36,60.41 25.96,55.41 41.06,57.01 23.16,55.41 28.46,48.21 45.58,30.56 55.66,26.71 54.06,40.71 60.25,26.45 36.64,23.7 27.06,23.21 23.36,20.21 62.96,54.71 51.76,44.51 44.46,33.51 53.26,68.51 50.26,83.61 62.16,31.11 63.16,21.51 39.36,50.91 34.86,47.51 71.86,79.11 57.36,75.61 60.96,87.81 23.46,31.21 44.46,50.21 50.76,55.31 43.76,65.81 41.66,66.51 100.52,91 99.86,90.34 99.2,89.68 87.21,88.25 86.22,88.25 85.23,88.25 24.29,83.63 23.3,83.63 22.31,83.63 21.11,98.67 20.32,99.37 19.53,100.07 86.56,67.01 31.16,43.91 28.16,45.81 23.06,51.31 42.86,44.11 84.76,68.51 68.96,86.21 70.86,87.51 60.46,83.91 52.16,33.71 80.06,54.71 23.96,19.61 6.26,15.11 7.76,13.41 23.06,15.71 24.06,15.71 47.56,25.81 42.56,23.71 32.36,70.61 44.86,69.21 38.76,71.41 55.96,60.51 46.16,49.71 56.86,40.31 9.36,20.71 8.76,20.11 54.46,20.71 77.16,53.51 57.36,47.61
  pour Bottom: 17.66,109.51 23.36,103.91 arc37 48.76,91.61 arc51 86.46,103.91 arc4 91.96,109.51 109.56,91.81 108.26,90.61 104.24,86.6 99,80.1 87.6,80.14 87.54,83.91 74.16,83.9 74.11,74.93 87.55,74.89 87.6,80.01 98.95,79.98 97.28,77.26 94.56,71.61 93.56,68.91 92.56,65.31 91.46,58.91 91.36,54.71 91.46,53.11 77.56,53.11 77.56,45.61 92.26,45.61 92.56,43.91 94.46,38.31 96.56,33.41 100.56,27.11 108.36,18.81 109.66,17.41 91.96,-0.09 85.86,5.91 81.96,9.11 76.16,12.81 arc19 69.76,15.51 67.56,16.41 61.26,17.81 54.46,18.11 48.06,17.71 41.36,16.11 36.16,14.11 29.96,10.91 23.16,5.51 17.76,-0.09 0.06,17.61 5.86,23.51 arc26 15.76,39.61 arc19 18.26,54.81 arc48 3.16,88.51 arc-12 0.06,91.91
  pour Top: 17.66,109.61 23.36,104.01 arc37 48.76,91.71 arc51 86.46,104.01 arc4 91.96,109.61 109.56,91.91 108.26,90.71 104.76,87.01 101.84,83.93 98.99,80.09 87.53,80.07 87.51,83.96 74.13,83.93 74.13,74.91 87.55,74.89 87.52,79.89 98.94,79.96 95.85,74.59 93.76,69.51 93.46,68.51 92.46,65.01 91.46,58.91 91.36,54.71 91.46,53.41 91.46,53.11 77.56,53.11 77.56,45.61 92.26,45.61 92.96,42.71 94.46,38.31 96.56,33.51 100.56,27.21 108.36,18.91 109.66,17.51 91.96,0.01 85.86,6.01 81.96,9.21 76.16,12.91 arc19 69.76,15.61 67.56,16.51 61.26,17.91 54.46,18.21 48.06,17.81 41.36,16.21 36.16,14.21 29.96,11.01 23.16,5.61 17.76,0.01 0.06,17.71 5.86,23.61 arc26 15.76,39.71 arc19 18.26,54.91 arc48 3.16,88.61 arc-12 0.06,92.01
N$1
  Top 0.2: LED2.A R20.1
N$2
  Top 0.2: U$11.B2 55.95,71.22 55.36,71.81 55.11,71.81 C28.2 54.47,72.25 R2.2
N$3
  Top 0.2: LED3.A R21.1
N$6
  Top 0.2: R12.1 24.96,43.93 24.96,46.11 25.26,46.41 26.36,46.41 26.86,46.91 26.86,47.81 28.16,49.11 29.65,49.11 IC1.62
N$7
  Top 0.2: Q1.3 24.07,41.61 | 24.07,41.61 R12.2 | 24.07,41.61 24.21,41.61 C13.1
N$8
  Top 0.2: Q1.1 21.36,45.46 C12.1 22.94,46.09 23.66,46.81 26.16,46.81 26.46,47.11 26.46,48.01 27.96,49.51 29.35,49.51 IC1.61
N$9  (via drill 0.2)
  Top 0.2: JP4.1 49.9,73.08 R7.1 50.96,72.63 R4.2 52.26,73.41 v52.06,73.61 | U$22.P$2 57.26,74.61 56.86,75.01 55.97,75.01 R3.2 55.87,75.11 55.66,75.11 v54.96,75.81
  Bottom 0.2: v54.96,75.81 52.76,73.61 v52.06,73.61
N$10
  Top 0.2: U$9.P$2 53.26,73.8 R2.1 53.04,77.14 SJ1.1
N$11
  Top 0.2: L1.2 85.56,60.41 85.86,60.71 86.96,60.71 X3.1
N$12
  Top 0.2: R3.1 55.96,72.19 U$11.C2
N$13
  Top 0.2: D1.2 83.69,61.27 R10.1 85.19,60.74 85.86,61.41 87,61.41 X3.2
N$14
  Top 1.016: M1/MOTOR.5 13.44,99.85 | M1/MOTOR.6 11.64,101.65 11.64,101.54 | 30.45,95.62 JP15.1
  Top 1.422: 11.64,101.54 M1/MOTOR.5 | 13.44,99.85 19.04,94.34 29.17,94.34 30.45,95.62
N$15
  Top 0.406: R5.1 79.08,74.56 LED6.A
N$16  (via drill 0.2)
  Top 0.2: v43.16,39.41 41.86,38.11 40.56,38.11 R37.1 | v44.56,38.01 45.26,38.01 48.56,41.31 54.76,41.31 v54.96,41.11 | M3/DY.5 81.86,38.51 81.16,39.21 79.66,39.21 76.96,41.91 76.96,43.21 77.36,43.61 77.36,46.31 76.66,47.01 72.46,47.01 69.26,50.21 | v74.46,64.21 68.66,70.01 68.66,79.11 67.96,79.81 67.96,80.41 69.26,81.71 69.26,83.71 M2/DY.6 | 69.26,50.21 69.26,56.51 74.86,62.11 v74.86,62.21 | v57.76,44.11 57.76,46.41 58.56,47.21 66.26,47.21 69.26,50.21
  Bottom 0.2: v44.56,38.01 v43.16,39.41 | v54.96,41.11 57.06,41.11 57.76,41.91 v57.76,44.11 | v74.46,64.21 75.26,63.41 75.26,62.61 v74.86,62.21
N$18
  Top 0.2: LED1.A R6.1
N$20
  Top 0.2: IC2.10 54.56,57.47 C19.2
N$21
  Top 1.016: M1/MOTOR.4 9.84,99.85 | M1/MOTOR.3 11.64,98.05 | 33.22,94.21 JP15.2
  Top 1.422: M1/MOTOR.3 M1/MOTOR.4 | 11.64,98.05 17.37,92.32 31.33,92.32 33.22,94.21
N$22
  Top 0.2: LED4.A R22.1
N$23  (via drill 0.2)
  Top 0.2: IC1.10 46.28,62.81 55.96,62.81 56.76,63.61 76.06,63.61 v76.26,63.81 | D2.A 80.58,57.49 JP14.1
  Top 0.406: L1.1 82.47,59.03 D2.A
  Bottom 0.2: v76.26,63.81 77.16,63.81 78.66,62.31 78.66,58.57 JP14.1
N$24
  Top 0.2: LED5.A R23.1
N$25
  Top 1.016: M1/MOTOR.1 9.84,96.26 | M1/MOTOR.2 8.05,98.05 8.05,97.95
  Top 1.422: 8.05,97.95 M1/MOTOR.1 | 9.84,96.26 16.11,90 32.75,90 35.48,92.73 JP15.3
N$26
  Top 0.2: U$13.P_6 44.09,24.75 R24.1
N$28
  Top 0.2: JP8.2 47.84,21.83 U$13.P_3 U$13.P_2 U$13.P_5
N$29
  Top 0.2: R25.1 46.1,85.13 U$15.P_6
N$30
  Top 0.2: U$15.P_5 U$15.P_2 U$15.P_3 43.93,87.74 43.46,88.21 43.46,89.49 JP9.2
N$31
  Top 0.2: U$18.P_6 65.06,84.91 66.56,84.91 66.66,85.01 R26.1
N$32
  Top 0.2: JP10.2 62.82,87.49 U$18.P_3 U$18.P_2 U$18.P_5
N$33
  Top 0.2: U$20.P_6 62.06,24.91 60.66,24.91 60.56,24.81 R27.1
N$34
  Top 0.2: JP11.2 64.41,22.15 U$20.P_3 63.06,22.61 U$20.P_2 63.06,22.71 63.06,24.91 U$20.P_5
N$35
  Top 1.016: M2/MOTOR.5 99.77,96.28 | M2/MOTOR.6 101.56,98.07 101.56,97.97
  Top 1.422: 101.56,97.97 M2/MOTOR.5 | 99.77,96.28 93.97,90.58 93.97,79.45 JP16.1
N$36
  Top 0.2: D1.1 83.69,63.78 R11.1 85.06,64.11 86.16,63.01 86.16,62.31 86.49,61.98 X3.3
N$37
  Top 0.2: JP19.1 85.15,25.24 R13.1
N$38
  Top 1.016: M2/MOTOR.1 96.18,99.87 | M2/MOTOR.2 97.97,101.66 97.97,101.56
  Top 1.422: 97.97,101.56 M2/MOTOR.1 | 96.18,99.87 89.53,93.22 89.53,75.28 91.98,74.13 JP16.3
N$40
  Top 1.016: M2/MOTOR.4 99.77,99.87 99.77,99.77 | M2/MOTOR.3 97.97,98.07
  Top 1.422: 99.77,99.77 M2/MOTOR.3 91.65,91.75 91.65,77.75 JP16.2
N$41
  Top 0.2: JP19.2 87.69,24.46 R28.1
N$42
  Top 1.016: M4/MOTOR.5 9.77,13.34 | M4/MOTOR.6 7.97,11.55 7.97,11.59
  Top 1.422: 7.97,11.59 M4/MOTOR.5 14.52,18.14 14.52,29.95 14.03,30.45 JP18.1
N$43
  Top 0.2: R29.1 91.56,25.41 90.26,26.71 JP19.3
N$45
  Top 1.016: M4/MOTOR.1 13.36,9.75 | M4/MOTOR.2 11.56,7.96 11.56,8
  Top 1.422: 11.56,8 M4/MOTOR.1 19.46,15.9 19.46,32.94 17.24,35.17 JP18.3
N$46
  Top 1.016: M4/MOTOR.4 9.77,9.75 9.77,9.8 | M4/MOTOR.3 11.56,11.55
  Top 1.422: 9.77,9.8 M4/MOTOR.3 17.14,17.17 17.14,32.15 15.99,33.3 JP18.2
N$49
  Top 1.016: M3/MOTOR.6 98.03,7.94 98.03,7.97 | M3/MOTOR.5 96.23,9.73 | 78.97,14.5 JP17.1
  Top 1.422: 98.03,7.97 M3/MOTOR.5 | 96.23,9.73 90.18,15.48 79.65,15.48 78.97,14.5
N$50
  Top 1.016: M3/MOTOR.3 97.43,12.03 | M3/MOTOR.4 99.82,9.73 99.82,9.77 | 76.4,15.85 JP17.2
  Top 1.422: 99.82,9.77 M3/MOTOR.3 | 97.43,12.03 91.65,17.8 78.16,17.8 76.4,15.85
N$53
  Top 1.016: M3/MOTOR.2 101.62,11.53 101.62,11.57 | M3/MOTOR.1 99.82,13.33 | 74.14,17 JP17.3
  Top 1.422: 101.62,11.57 M3/MOTOR.1 | 99.82,13.33 93.02,19.92 76.87,19.92 74.14,17
N$54  (via drill 0.2)
  Top 0.2: v58.56,33.71 67.16,33.71 70.66,30.21 72.76,30.21 76.66,26.31 77.46,26.31 81.86,30.71 v81.86,33.81 | M3/DY.6 83.66,40.21 83.66,38.21 80.76,35.31 v80.16,35.31 | v37.86,34.11 v37.86,34.12 R38.1
  Bottom 0.2: 40.61,31.36 41.66,32.41 44.86,32.41 46.86,34.41 55.66,34.41 56.36,33.71 v58.56,33.71 | 40.61,31.36 38.56,29.31 38.56,27.71 M4/DY.5 | 40.61,31.36 v37.86,34.11 | v81.86,33.81 v80.16,35.31
N$55  (via drill 0.2)
  Top 0.2: M1/DY.6 27.58,69.33 27.66,69.31 27.96,69.31 29.16,70.51 30.26,70.51 33.26,67.51 v33.56,67.51 | 44.26,72.31 v44.36,72.41 44.26,72.41 40.01,68.16 v39.96,68.21 39.26,68.91 39.16,68.91 R35.1
  Bottom 0.2: v44.36,72.41 48.86,76.91 69.26,76.91 71.06,78.71 71.06,81.88 M2/DY.5 | v33.56,67.51 39.26,67.51 v39.96,68.21
P0.0  (via drill 0.2)
  Top 0.2: v49.96,57.71 49.66,58.01 47.96,58.01 47.06,57.11 46.16,57.11 45.66,56.61 IC1.2 | v49.76,56.51 49.76,52.11 51.16,50.71 51.16,50.41 52.16,49.41 52.16,49.21 52.36,49.01 52.36,48.71 v52.56,48.51 | v51.46,47.21 51.46,45.11 50.16,43.81 50.16,43.51 49.16,42.51 46.26,42.51 v45.26,41.51 | v46.26,40.51 44.36,38.61 44.16,38.61 42.06,36.51 42.26,36.31 42.26,35.71 v42.46,35.51 | v39.66,21.91 35.26,17.51 34.26,17.51 26.66,25.11 24.76,25.11 23.66,26.21 22.66,26.21 JP500.8 | v40.66,23.01 40.66,25.61 40.36,25.91 M4/DY.6 40.26,26.01 39.56,26.71 39.56,28.41 39.06,28.91 39.06,30.81 41.56,33.31 v41.56,34.61
  Bottom 0.2: v49.96,57.71 50.46,57.21 v49.76,56.51 | v52.56,48.51 52.56,48.31 v51.46,47.21 | v46.26,40.51 v45.26,41.51 | v41.56,34.61 v42.46,35.51 | v39.66,21.91 39.66,22.01 v40.66,23.01
P0.1  (via drill 0.2)
  Top 0.2: v50.06,46.01 49.46,46.61 47.76,46.61 44.26,43.11 44.26,41.61 R36.1 | v51.76,48.71 51.76,49.21 50.76,50.21 50.76,50.51 49.36,51.91 49.36,53.01 48.16,54.21 46.46,54.21 v46.06,54.61 | IC1.1 46.06,56.11 45.36,55.41 v45.06,55.41 44.86,55.21 v43.46,55.21 | v19.26,41.31 22.56,38.01 22.56,28.81 JP500.7 | v41.06,55.91 40.96,55.91 v34.46,62.41 | v32.76,64.11 32.66,64.11 29.96,66.81 28.66,66.81 27.76,65.91 24.76,68.91 24.76,69.71 26.96,71.91 27.66,71.21 M1/DY.5 | v26.96,74.11 25.36,74.11 19.26,68.01 v19.26,67.91
  Bottom 0.2: v50.06,46.01 50.06,47.01 v51.76,48.71 | v46.06,54.61 45.16,55.51 v45.06,55.41 | v19.26,67.91 v19.26,41.31 | M1/DY.5 27.66,71.21 27.66,73.41 v26.96,74.11 | v43.46,55.21 43.36,55.11 41.86,55.11 v41.06,55.91 | v32.76,64.11 v34.46,62.41
P0.2  (via drill 0.2)
  Top 0.2: v61.46,21.91 62.06,22.51 U$20.P_1 | v58.06,21.91 58.06,22.41 53.76,26.71 53.76,27.51 v52.66,28.61 | v53.56,29.51 55.76,31.71 55.96,31.71 57.96,33.71 57.96,34.01 58.66,34.71 61.06,34.71 62.66,36.31 59.56,39.41 59.26,39.41 v56.76,41.91 | v50.86,46.21 50.76,46.21 50.36,46.61 50.06,46.61 v49.46,47.21 | v49.46,48.51 49.46,49.91 48.36,51.01 48.36,51.71 46.86,53.21 46.46,53.21 45.96,53.71 IC1.100
  Bottom 0.2: v58.06,21.91 v61.46,21.91 | v53.56,29.51 v52.66,28.61 | v49.46,48.51 v49.46,47.21 | v50.86,46.21 51.86,46.21 56.16,41.91 v56.76,41.91
P0.3  (via drill 0.2)
  Top 0.2: v61.56,77.51 59.76,75.71 v59.76,68.51 | v46.56,52.61 46.46,52.61 45.66,53.41 IC1.99 | 65.06,87.21 U$18.P_1 65.06,87.11 65.06,86.81 65.96,85.91 67.26,85.91 v67.76,85.41
  Bottom 0.2: v59.76,68.51 49.26,58.01 47.46,58.01 46.76,57.31 45.46,57.31 44.16,56.01 44.16,55.01 v46.56,52.61 | v67.76,85.41 67.76,83.71 v61.56,77.51
P0.4  (via drill 0.2)
  Top 0.2: v46.96,51.31 45.26,53.01 IC1.98
  Bottom 0.2: v46.96,51.31 46.76,51.31 44.76,49.31 44.06,49.31 43.16,48.41 38.46,48.41 35.96,50.91 35.16,50.11 35.16,49.41 35.06,49.31 35.06,48.71 45.56,38.21 46.86,39.51 59.56,39.51 66.86,32.21 66.46,31.81 66.46,30.81 69.26,28.01 76.46,28.01 RC.3
P0.5
  Top 0.2: 53.26,57.11 53.26,58.31 53.56,58.61 55.76,58.61 58.16,61.01 59.91,61.01 JP1.8 | 53.26,57.11 47.66,57.11 44.36,53.81 44.36,53.26 IC1.97 | 53.26,57.11 53.76,56.62 IC2.12
P0.9  (via drill 0.2)
  Top 0.2: R20.2 v61.16,70.81 | v48.96,58.61 46.22,58.61 IC1.4
  Bottom 0.2: v61.16,70.81 v48.96,58.61
P0.10  (via drill 0.2)
  Top 0.2: v46.46,57.91 46.06,57.51 45.86,57.51 45.36,57.01 45.26,57.01 IC1.3
  Bottom 0.2: v46.46,57.91 46.46,59.41 45.56,60.31 45.56,61.51 46.46,62.41 46.46,68.71 48.26,70.51 JP4.2 48.26,70.61
P1.0
  Top 0.2: R36.2 43.06,40.61 42.96,40.61 41.96,41.61 R34.1 41.86,41.71 41.66,41.91 41.66,43.31 40.56,44.41 40.46,44.41 38.56,46.31 IC1.79
P1.1  (via drill 0.2)
  Top 0.2: 38.96,70.51 39.16,70.51 R35.2 39.37,70.43 39.86,70.91 39.86,71.71 39.46,72.11 36.96,72.11 36.56,71.71 36.56,67.81 35.36,66.61 35.36,65.41 37.76,63.01 37.76,62.61 38.26,62.11 38.26,60.71 41.66,57.31 41.66,54.11 35.46,47.91 35.46,46.91 v35.56,46.81 | v36.36,45.61 37.46,46.71 38.16,46.01 IC1.78 38.26,45.91 40.46,43.71 40.46,43.31 R33.1
  Bottom 0.2: v35.56,46.81 36.56,45.81 v36.36,45.61
P1.2  (via drill 0.2)
  Top 0.2: R32.1 38.46,38.21 39.46,37.21 39.46,37.11 R37.2 39.16,37.41 v38.56,36.81 | v40.86,39.11 41.76,40.01 41.76,40.51 40.46,41.81 40.46,42.11 38.36,44.21 38.36,45.11 37.86,45.61 IC1.77
  Bottom 0.2: v38.56,36.81 v40.86,39.11
P1.3
  Top 0.2: IC1.76 37.46,45.21 37.46,41.31 36.66,40.51 37.26,39.91 R31.1 37.22,37.18 R38.2
P1.5  (via drill 0.2)
  Top 0.2: v37.96,47.51 37.76,47.71 36.26,46.21 35.26,46.21 34.76,45.71 IC1.74 | v39.86,46.01 42.86,46.01 v43.16,45.71 | v56.46,50.21 58.36,50.21 58.76,49.81 62.26,49.81 v66.06,53.61
  Bottom 0.2: 67.26,52.75 SJ2.1 67.26,52.81 67.06,52.61 v66.06,53.61 | v37.96,47.51 39.66,45.81 v39.86,46.01 | v43.16,45.71 43.26,45.71 47.46,49.91 56.16,49.91 v56.46,50.21
P1.5B
  Top 0.2: R9.2 70.63,39.36 JP2.4 73.39,44.6 U$16.P13_RX
  Bottom 0.2: JP2.4 69.36,43.11 69.36,45.31 64.75,49.92 SJ3.2
P1.15  (via drill 0.2)
  Top 0.2: v52.06,36.61 51.86,36.41 51.86,35.01 52.66,34.21 52.86,34.21 U$8.P5 | v36.86,42.01 31.96,46.91 31.96,47.01 31.86,47.11 32.46,47.71 IC1.68 | v43.76,37.21 45.06,37.21 45.56,36.71 46.36,36.71 48.06,38.41 JP3.3
  Bottom 0.2: v52.06,36.61 49.96,38.71 49.66,38.41 JP3.3 | v36.86,42.01 38.96,42.01 v43.76,37.21
P2.0  (via drill 0.2)
  Top 0.2: v44.66,21.81 44.76,21.71 45.36,22.31 U$13.P_1 | v40.36,20.91 v42.06,19.21 | v25.46,52.01 26.86,53.41 IC1.52
  Bottom 0.2: v42.06,19.21 v44.66,21.81 | v40.36,20.91 25.56,20.91 20.24,26.23 20.24,38.09 21.46,39.31 21.46,48.01 v25.46,52.01
P2.1  (via drill 0.2)
  Top 0.2: v26.06,54.21 26.46,53.81 IC1.51
  Bottom 0.2: v26.06,54.21 26.06,29.71 25.16,28.81 JP500.5
P2.4  (via drill 0.2)
  Top 0.2: 49.21,34.76 48.16,35.81 JP3.2 | 49.21,34.76 49.91,34.06 | 49.91,34.06 50.16,33.81 50.16,32.11 51.86,30.41 52.86,30.41 53.46,31.01 53.46,33.31 54.26,34.11 U$8.P4 | R16.2 54.46,37.81 54.26,37.81 53.36,38.71 50.36,38.71 49.96,38.31 49.96,34.11 49.91,34.06 | v28.86,53.51 27.86,54.51 27.86,56.31 27.26,56.91 IC1.48 | v33.36,43.71 33.36,42.11 34.56,40.91 34.56,40.31 35.96,38.91 35.96,38.01 35.46,37.51 37.16,35.81 v39.46,35.81 | v42.76,34.71 49.16,34.71 49.21,34.76
  Bottom 0.2: v28.86,53.51 28.86,48.71 32.36,45.21 32.36,44.71 v33.36,43.71 | v39.46,35.81 41.66,33.61 v42.76,34.71
P2.5  (via drill 0.2)
  Top 0.2: R17.2 54.86,32.57 | 54.86,32.57 55.7,32.57 v55.76,32.51 | 54.26,34.91 U$8.P3 54.36,34.81 54.56,34.81 54.86,34.51 54.86,32.57 | v41.26,24.71 41.96,25.41 46.16,25.41 47.36,26.61 47.36,30.71 48.06,31.41 48.06,33.31 JP3.1 | v39.06,22.51 34.46,17.91 26.56,25.81 26.56,26.41 25.56,27.41 24.96,27.41 24.06,28.31 24.06,37.11 20.46,40.71 20.46,50.31 23.66,53.51 23.66,54.41 v23.46,54.61 | IC1.47 27.56,57.31 26.86,58.01 26.46,58.01 25.06,56.61 v25.06,56.21
  Bottom 0.2: v55.76,32.51 48.93,32.51 JP3.1 | v39.06,22.51 v41.26,24.71 | v25.06,56.21 v23.46,54.61
P2.7  (via drill 0.2)
  Top 0.2: v48.36,77.31 48.36,85.71 48.06,86.01 46.76,86.01 45.86,86.91 45.86,87.21 U$15.P_1 | v27.26,54.81 27.26,54.51 27.86,53.91 27.86,53.71 27.26,53.11 IC1.53
  Bottom 0.2: v48.36,77.31 43.76,72.71 43.76,70.81 34.76,61.81 34.26,61.81 v27.26,54.81
P3.0  (via drill 0.2)
  Top 0.2: R22.2 62.06,75.91 v60.66,74.51 | v46.26,60.61 46.1,60.61 IC1.7
  Bottom 0.2: v46.26,60.61 47.66,60.61 47.86,60.41 48.96,60.41 59.56,71.01 59.56,73.41 v60.66,74.51
P3.1  (via drill 0.2)
  Top 0.2: R23.2 61.94,73.81 61.36,73.81 v60.66,73.11 | v47.36,60.01 46.21,60.01 IC1.6
  Bottom 0.2: v60.66,73.11 59.96,72.41 59.96,70.81 49.16,60.01 v47.36,60.01
P3.2  (via drill 0.2)
  Top 0.2: IC1.5 46.32,59.41 v48.26,59.41 | v60.56,71.71 61.36,72.51 R21.2
  Bottom 0.2: v48.26,59.41 49.16,59.41 60.56,70.81 v60.56,71.71
P5.0  (via drill 0.2)
  Top 0.2: 58.06,53.41 57.26,53.41 56.86,53.01 56.06,53.01 IC2.24 | JP1.4 59.45,51.41 58.96,51.41 58.41,51.96 R15.1 58.06,53.41 | 28.96,51.21 IC1.58 29.06,51.31 29.86,52.11 30.26,51.71 v30.36,51.71 | v31.56,51.11 34.46,51.11 v35.76,49.81 | v37.26,48.71 38.16,48.71 41.86,52.41 41.66,52.61 v41.66,52.71 | v51.86,57.71 53.46,59.31 53.46,60.21 54.86,61.61 58.16,61.61 58.96,62.41 60.96,62.41 61.86,61.51 61.86,57.21 58.06,53.41
  Bottom 0.2: v30.36,51.71 31.26,50.81 v31.56,51.11 | v35.76,49.81 37.06,48.51 v37.26,48.71 | v41.66,52.71 42.96,54.01 43.96,54.01 46.36,51.61 46.66,51.91 47.06,51.91 48.46,53.31 48.46,54.31 v51.86,57.71
P5.1  (via drill 0.2)
  Top 0.2: v27.46,51.11 27.66,50.91 27.96,50.91 28.66,51.61 IC1.57 | v65.26,60.61 64.76,60.11 v64.76,54.31
  Bottom 0.2: v27.46,51.11 27.46,53.91 36.86,63.31 37.16,63.31 46.16,72.31 46.86,72.31 47.56,71.61 51.56,71.61 53.56,73.61 58.86,73.61 60.36,75.11 61.06,75.11 61.76,74.41 61.76,62.91 64.06,60.61 v65.26,60.61 | v64.76,54.31 v64.75,54.3 SJ3.1
P5.1B
  Top 0.2: U$16.P14_TX 75.83,45.71 73.66,45.71 72.33,44.38 JP2.2 70.63,43.98 69.46,42.81 69.46,39.33 R8.2
  Bottom 0.2: JP2.2 70.42,44.59 70.42,44.95 67.46,47.91 67.46,51.52 SJ2.2
P5.2  (via drill 0.2)
  Top 0.2: JP1.3 59.96,48.41 59.76,48.61 57.06,48.61 R14.1 57.06,48.71 55.71,50.06 | v30.36,52.51 29.56,53.31 28.36,52.11 IC1.56 | v42.86,49.01 47.16,49.01 47.46,48.71 48.16,48.71 48.96,49.51 v47.96,50.51 | v52.16,50.91 53.16,50.91 53.26,50.81 54.96,50.81 55.71,50.06 | 55.71,50.06 55.71,50.36 56.16,50.81 56.16,51.91 55.36,52.71 IC2.23
  Bottom 0.2: 59.96,48.41 JP1.3 | v30.36,52.51 39.36,52.51 v42.86,49.01 | v47.96,50.51 48.16,50.31 49.46,50.31 49.86,50.71 51.96,50.71 v52.16,50.91
P14.5  (via drill 0.2)
  Top 0.2: v37.16,62.71 35.26,64.61 35.06,64.61 IC1.26 34.96,64.78 34.96,68.01 C29.1 | v44.66,67.81 61.36,67.81 62.06,67.11 70.66,67.11 v73.56,64.21 | v84.16,42.41 84.16,42.01 86.96,39.21 86.96,35.81 85.16,34.01 85.16,32.21 v84.56,31.61 84.06,31.11 84.06,25.51 84.46,25.11 R18.1 84.47,24.48 R13.2
  Bottom 0.2: v37.16,62.71 39.56,62.71 v44.66,67.81 | v73.56,64.21 73.56,54.91 77.26,51.21 77.26,48.21 79.26,46.21 80.36,46.21 v84.16,42.41 | v84.56,31.61 84.76,31.81
P14.7  (via drill 0.2)
  Top 0.2: 92.36,23.21 93.26,23.21 R30.1 | 92.36,23.21 R29.2 | 39.91,66.46 42.46,69.01 44.26,67.21 56.56,67.21 v59.56,64.21 | 39.91,66.46 37.86,64.41 IC1.24 | v71.56,52.21 75.16,48.61 75.76,48.61 78.26,46.11 79.46,46.11 86.56,39.01 86.56,36.31 v86.36,36.11 | 92.36,23.21 92.36,25.21 91.36,26.21 91.36,27.91 90.36,28.91 88.96,28.91 87.96,29.91 87.96,33.11 87.26,33.81 v87.26,35.21 | 39.91,66.46 37.64,68.73 C31.1
  Bottom 0.2: v71.56,52.21 v59.56,64.21 | v87.26,35.21 v86.36,36.11
P14.8  (via drill 0.2)
  Top 0.2: v33.76,58.21 31.16,60.81 IC1.37 31.06,60.91 30.26,61.71 29.06,61.71 28.56,62.21 v28.26,62.21 | v42.86,56.11 42.86,53.61 v43.46,53.01 | v45.16,51.31 46.06,51.31 46.56,50.81 46.56,50.51 v47.76,49.31 | v87.06,21.81 87.06,22.4 R28.2 87.76,23.1 R19.1 | 33.56,68.81 33.76,68.81 C30.1 33.35,68.72 v32.66,69.41
  Bottom 0.2: v33.76,58.21 40.76,58.21 v42.86,56.11 | v45.16,51.31 v43.46,53.01 | v47.76,49.31 54.16,49.31 59.06,44.41 63.16,44.41 67.08,40.49 67.08,33.69 70.6,30.17 76.4,30.17 78.66,27.91 81.06,27.91 v87.06,21.81 | v28.26,62.21 32.86,66.81 32.86,69.21 v32.66,69.41
RESET#  (via drill 0.2)
  Top 0.2: IC1.65 30.76,48.1 30.76,47.11 28.26,44.61 28.26,43.31 29.06,42.51 29.06,41.61 26.46,39.01 26.46,27.31 27.5,26.27 JP500.4 27.76,26.21 34.16,19.81 v35.46,19.81 | 49.36,29.21 49.36,30.01 49.26,30.11 SW3.P1 | 49.36,29.21 49.36,28.81 C20.1 49.36,29.21 | SW3.P 58.36,28.81 R1.1 58.26,28.81 58.16,28.91 53.26,28.91 52.96,29.21 50.66,29.21 | 50.66,29.21 49.36,29.21 | v50.66,22.01 50.66,29.21 | v41.06,18.21 37.06,18.21 v36.96,18.31
  Bottom 0.2: v50.66,22.01 47.76,22.01 46.76,21.01 46.76,19.31 45.66,18.21 v41.06,18.21 | v35.46,19.81 v36.96,18.31
TCK  (via drill 0.2)
  Top 0.2: v34.06,48.01 33.06,49.01 32.26,48.21 IC1.67 | v32.96,45.01 32.96,44.21 32.76,44.01 32.76,42.11 34.16,40.71 34.16,39.31 v31.36,36.51 | v29.46,34.61 29.46,30.6 JP500.3
  Bottom 0.2: v34.06,48.01 34.06,46.11 v32.96,45.01 | v31.36,36.51 v29.46,34.61
TMS
  Top 0.2: IC1.66 31.76,48.41 31.16,47.81 31.16,46.91 32.36,45.71 32.36,41.11 30.16,38.91 30.16,28.81 JP500.1
USB_DM
  Top 0.2: IC1.8 46.8,62.01 56.36,62.01 57.16,62.81 77.12,62.81 JP12.1 81.13,60.74 R10.2
USB_DP
  Top 0.2: IC1.9 46.49,62.41 56.16,62.41 56.96,63.21 79.42,63.21 JP13.1 81.8,64.12 R11.2
VAREF
  Top 0.2: IC1.33 31.55,63.24 C16.1 28.92,64.11 26.16,64.11 24.71,65.56 L2.1
VDD3.3  (via drill 0.2)
  Top 0.2: 53.26,36.81 52.76,37.31 R16.1 52.71,37.82 C14.1 | R15.2 60.06,53.41 v60.06,54.51 | R14.2 55.21,46.96 54.36,47.81 | 54.36,47.81 51.56,50.61 51.56,52.26 C21.2 52.36,51.66 C18.2 55.11,51.66 v55.16,51.61 55.16,52.21 54.96,52.41 IC2.22 | IC1.43 28.31,59.41 25.49,59.41 C4.1 24.26,58.41 | IC1.87 42.14,48.41 43.96,48.41 44.56,47.81 C6.1 54.36,47.81 | 24.26,49.61 C2.1 24.28,48.84 C5.1 25.56,47.71 27.76,49.91 29.04,49.91 IC1.60 | 53.26,36.81 55.26,36.81 56.23,37.78 56.23,37.88 | 61.86,19.91 JP11.1 | 58.46,27.11 R1.2 58.36,27.01 58.46,27.11 | 58.46,27.11 58.96,27.11 | IC1.11 42.36,59.71 41.76,59.11 41.66,59.21 41.56,59.21 39.76,61.01 39.76,61.31 40.26,61.81 IC1.17 41.63,63.21 C3.1 | 46.36,72.61 46.56,72.61 47.56,71.61 51.26,71.61 51.66,71.21 R4.1 | 51.56,78.51 51.7,78.51 | 45.66,72.01 45.66,71.91 45.71,71.86 | IC2.13 v52.06,55.81 | v55.66,57.51 55.36,57.21 IC2.8 | C15.2 51.26,32.57 R17.1 52.26,32.17 v52.26,31.31 | 53.26,36.81 53.26,36.52 U$8.P8 52.49,36.15 52.26,35.91 52.26,35.21 52.62,34.85 U$8.P6
  Top 0.406: 85.93,75.7 85.93,76.37 | 85.93,76.37 v85.93,77.41 | R5.2 80.73,74.66 v80.73,77.41 | 55.36,41.91 46.66,41.91 33.77,29.03 | 55.36,41.91 56.76,43.31 | 56.76,43.31 59.93,43.31 JP1.1 60.03,43.21 64.56,43.21 65.73,44.38 65.86,44.38 | C4.1 23.04,58.52 C1.1 22.02,58.15 21.26,58.91 21.26,61.78 L3.2 23.02,65.8 L2.2 23.01,70.02 JP20.2 JP20.1 26.06,73.01 43.16,73.01 43.66,73.51 46.36,73.51 46.41,73.56 | JP10.1 66.97,89.7 66.97,89.67 JP21.2 JP21.1 | JP2.1 65.86,44.38 | 65.86,44.31 65.86,44.38 | 55.36,41.91 55.76,41.51 55.76,38.35 56.23,37.88 JP6.1 | JP11.1 61.86,20.81 60.66,20.81 56.66,24.81 56.66,26.41 57.26,27.01 58.36,27.01 | 58.96,27.11 60.06,28.21 60.06,32.71 v60.26,32.91 | 75.29,80.21 v75.62,80.54 | 33.77,29.03 31.02,26.27 JP500.2 | 79.4,32.48 76.07,32.48 R9.1 R8.1 68.27,37.7 66.46,39.51 66.46,43.61 65.86,44.21 65.86,44.31 | 79.4,32.48 80.12,31.77 RC.1 | 85.93,76.37 85.27,75.71 84.46,75.71 84.46,74.15 C23.1 85.56,72.97 v85.56,65.51 | 24.26,58.41 24.26,49.62 C2.1 | JP21.1 | JP21.1 73.97,82.67 75.71,82.67 v76.22,82.16 | SJ1.2 51.7,78.51 51.7,80.48 v58.01,86.79 55.15,89.65 JP9.1 | JP8.1 42.67,19.95 JP22.1 JP22.2 36.7,26.11 33.77,29.03 | 79.4,32.48 79.48,32.48 JP23.2 JP23.1 | 51.56,78.51 46.41,73.56 | 46.41,73.56 46.36,73.51 46.36,72.61 46.36,72.51 45.71,71.86 43.76,69.91 v43.76,68.61 | v42.86,67.71 C3.1 | U$16.P11_VDD 62.61,45.71 64.46,45.71 65.86,44.31 | 56.76,43.31 56.76,46.06 R14.2
  Bottom 0.2: v60.06,54.51 57.16,51.61 v55.16,51.61 53.96,52.81 53.96,55.81 | v52.06,55.81 53.96,55.81 | 53.96,55.81 v55.66,57.51 | v52.26,31.31 52.46,31.51 56.96,31.51 58.36,32.91 v60.26,32.91
  Bottom 0.406: v60.26,32.91 60.26,33.85 JP6.1 | JP10.1 65.34,89.7 62.19,86.55 58.25,86.55 v58.01,86.79 | v85.56,65.51 89.56,61.51 89.56,53.61 85.46,49.51 85.48,49.49 JP23.1 | v43.76,68.61 v42.86,67.71
  other vias: 79.83,79.21 79.83,80.11 79.83,78.31 79.83,77.41 79.83,81.01 80.73,79.21 80.73,80.11 80.73,78.31 80.73,81.01 81.63,79.21 81.63,80.11 81.63,78.31 81.63,77.41 81.63,81.01 85.93,79.21 85.93,80.11 85.93,78.31 85.93,81.01 75.62,79.64 75.62,78.74 75.62,77.84 77.12,82.16 78.02,82.16 78.92,82.16 77.23,76.33 76.33,76.33 78.13,76.33 79.03,76.33
  pour Top: 74.83,83.33 74.73,83.33 74.73,75.51 86.87,75.51 86.83,83.28
  pour Bottom: 74.73,83.33 74.73,75.51 86.82,75.55 86.74,83.25
VDD5  (via drill 0.2)
  Top 0.2: 29.46,69.31 M1/DY.3 | R33.2 39.36,42.01 38.46,41.11 R31.2 38.46,41.01 39.76,39.71 R32.2 | R32.2 39.66,39.51 40.66,40.51 R34.2 | v40.66,36.91 39.56,38.01 39.56,39.41 R32.2 | v41.66,35.91 41.66,35.41 42.16,34.91 42.16,33.21 40.26,31.31 40.26,29.61 M4/DY.3 | 67.46,82.01 M2/DY.4
  Top 0.406: U$7.2 84.7,50.59 C26.1 84.76,53.58 C24.1 | JP5.1 87.47,55.51 C24.1 | C24.1 84.67,55.6 D2.C | C22.1 83.88,84.53 TO3.3V.3 84.02,81.49 v84.02,86.38 | M3/DY.4 M3/DY.3 | v72.58,47.77 69.94,50.41 69.94,54.59 71.48,56.13 71.48,56.24 76.54,56.24 80.86,51.92 v80.86,51.21 | v46.31,27.75 46.27,27.71 M4/DY.4 M4/DY.3 | v61.7,27.75 65.32,27.75 67.85,25.22 77.2,25.22 82.37,30.39 v82.81,30.39 | M2/DY.3 69.36,80.14 74.01,75.49 v74.01,74.72 | 29.46,69.31 27.76,67.61 M1/DY.4 | v43.36,86.61 v31.76,75.01 | v62.76,82.91 66.56,82.91 67.46,82.01 | v57.86,88.11 59.06,86.91 59.06,86.61 v61.66,84.01
  Bottom 0.2: v41.66,35.91 v40.66,36.91 | 29.46,69.41 M1/DY.3
  Bottom 0.406: v84.02,86.38 84.02,74.72 | 84.02,74.72 84.02,58.96 JP5.1 | v72.58,47.77 72.58,45.13 77.42,40.29 M3/DY.3 80.06,40.24 80.06,38.2 82.81,35.45 v82.81,30.39 | v46.31,27.75 v61.7,27.75 | M2/DY.4 M2/DY.3 | v74.01,74.72 84.02,74.72 | 29.46,69.41 29.46,72.71 v31.76,75.01 | v43.36,86.61 56.36,86.61 v57.86,88.11 | v62.76,82.91 v61.66,84.01
  other vias: 81.76,49.41 81.76,50.31 81.76,51.21 81.76,48.51 81.76,47.61 80.86,50.31 80.86,49.41 80.86,48.51 79.96,48.51 79.96,49.41 79.96,50.31 89.96,49.41 89.96,50.31 89.96,48.51 89.96,47.61 89.96,51.21
  pour Bottom: 91.36,52.51 78.16,52.51 78.16,46.21 92.16,46.21 91.86,47.71 91.66,49.51 91.46,51.71
  pour Top: 91.36,52.51 78.16,52.51 78.16,46.21 92.16,46.21 91.76,48.51 91.56,50.11
VDDA
  Top 0.2: L3.1 26.58,63.54 C17.1 28.11,63.26 29.26,62.11 31.27,62.11 IC1.35
VDDC  (via drill 0.2)
  Top 0.2: C8.1 26.71,61.72 IC1.42 29.46,59.01 29.46,58.91 29.96,58.41 29.96,53.91 30.96,52.91 30.96,50.81 31.76,50.01 31.76,49.81 | C10.1 26.71,45.71 26.86,45.71 28.3,47.15 C11.1 29.35,47.39 IC1.64 31.16,49.21 31.76,49.81 | C9.1 43.17,46.67 IC1.86 40.96,48.91 40.31,49.56 | 42.91,60.96 42.16,60.21 IC1.12 | 42.91,60.96 43.96,62.01 C7.1 | v40.86,59.01 40.86,58.71 42.06,57.51 42.06,53.21 42.26,53.01 42.26,51.61 40.26,49.61 40.31,49.56 | v42.86,61.01 42.91,60.96 | 31.76,49.81 34.86,49.81 v35.66,49.01 | v36.56,48.11 38.86,48.11 40.31,49.56
  Bottom 0.2: v40.86,59.01 v42.86,61.01 | v36.56,48.11 v35.66,49.01

### Text on the board
Top: Layer 1 TOP
Bottom: Layer 2 BOT
tPlace: Assembly | BPL
Measures: [mm]
Reference: Mechanical drawing | MPL
tSilk: TOP Silkscreen | U V W | W V U | U V W | 3V3 | 3V3 | www.mci.edu | PMM TI COP | FRONT | State1 | Origa | State2 | U V W | State3 | Origa | Bluetooth | MPU9x50 | Bluetooth / RN42 | XMC4500 | 5V | 9250 | F100K1024 | DPS310 | W V U | 7 | 5 | 3 | 1 | 3V3 | BAT IN | GND | RC-Control | P0.4 | 8 | 6 | 4 | 2 | RESET | DEBUG | 3V3 | 3V3 | BAT Safety | U V W | W V U | W V U
bSilk: BOT Silkscreen | www.mci.edu | PMM TI COP